# EasyEDA Pro project NRMgmtCRB_v2_final.epro, board PCB1
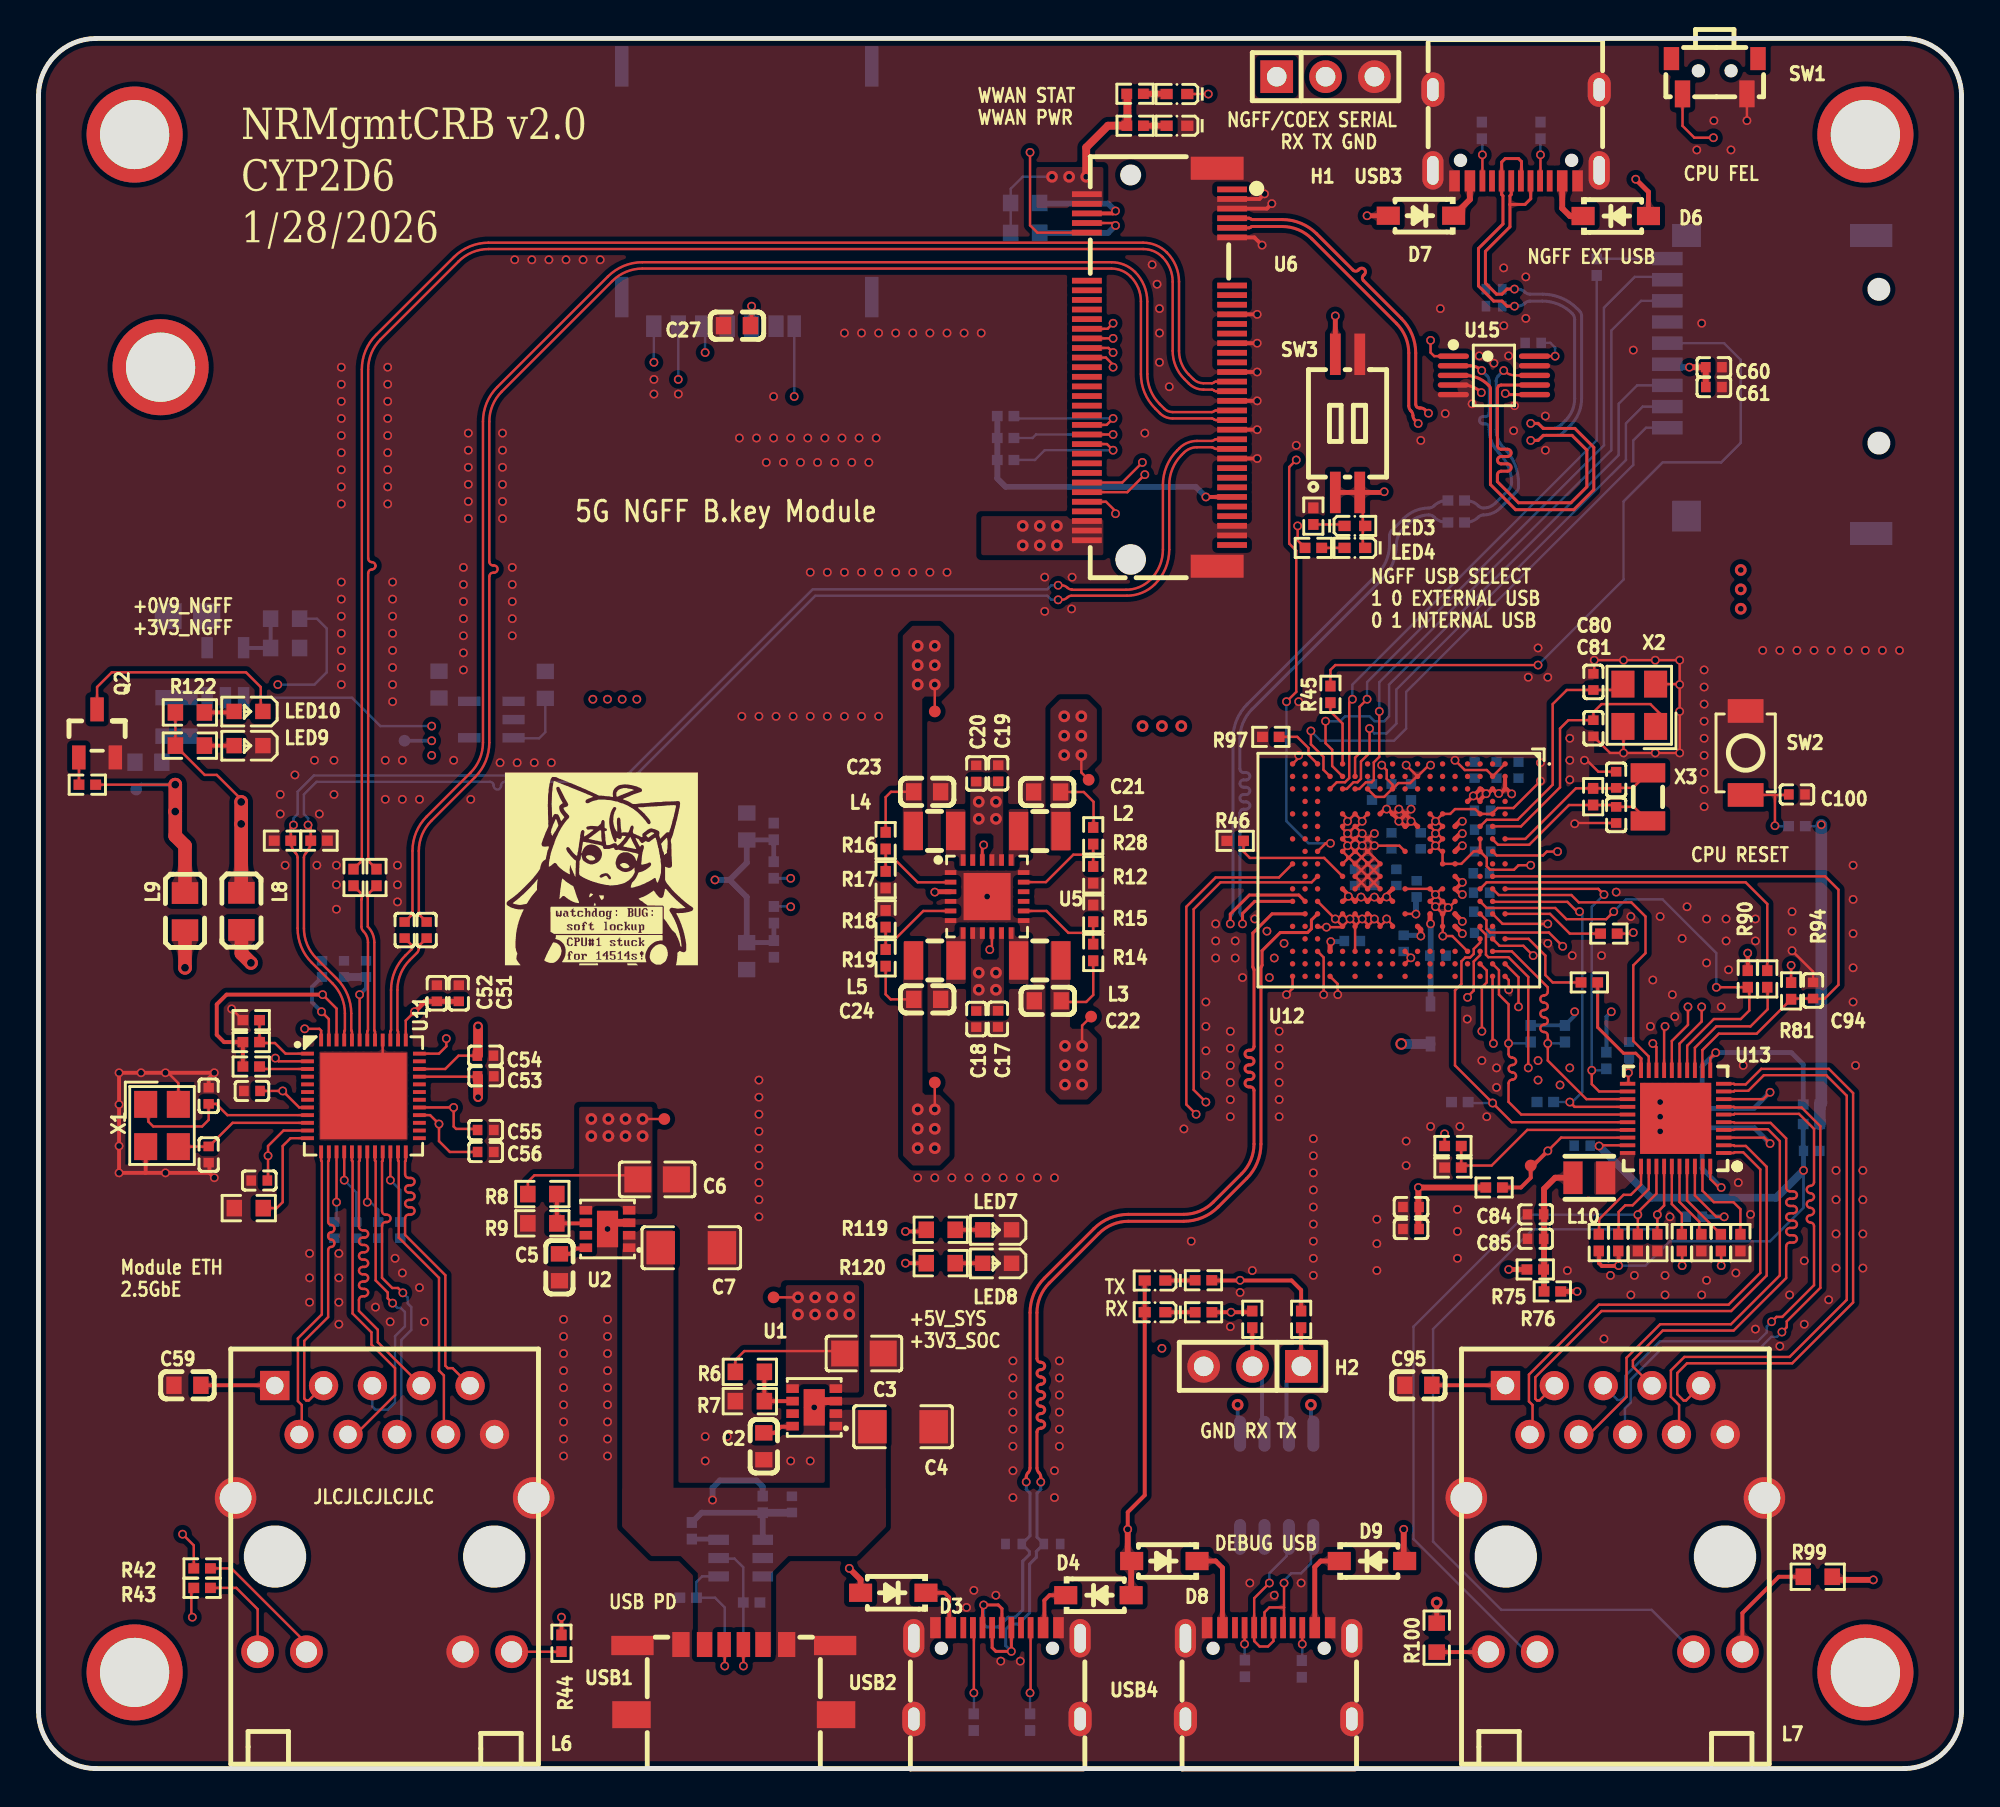
[diagram p3: board, top side]
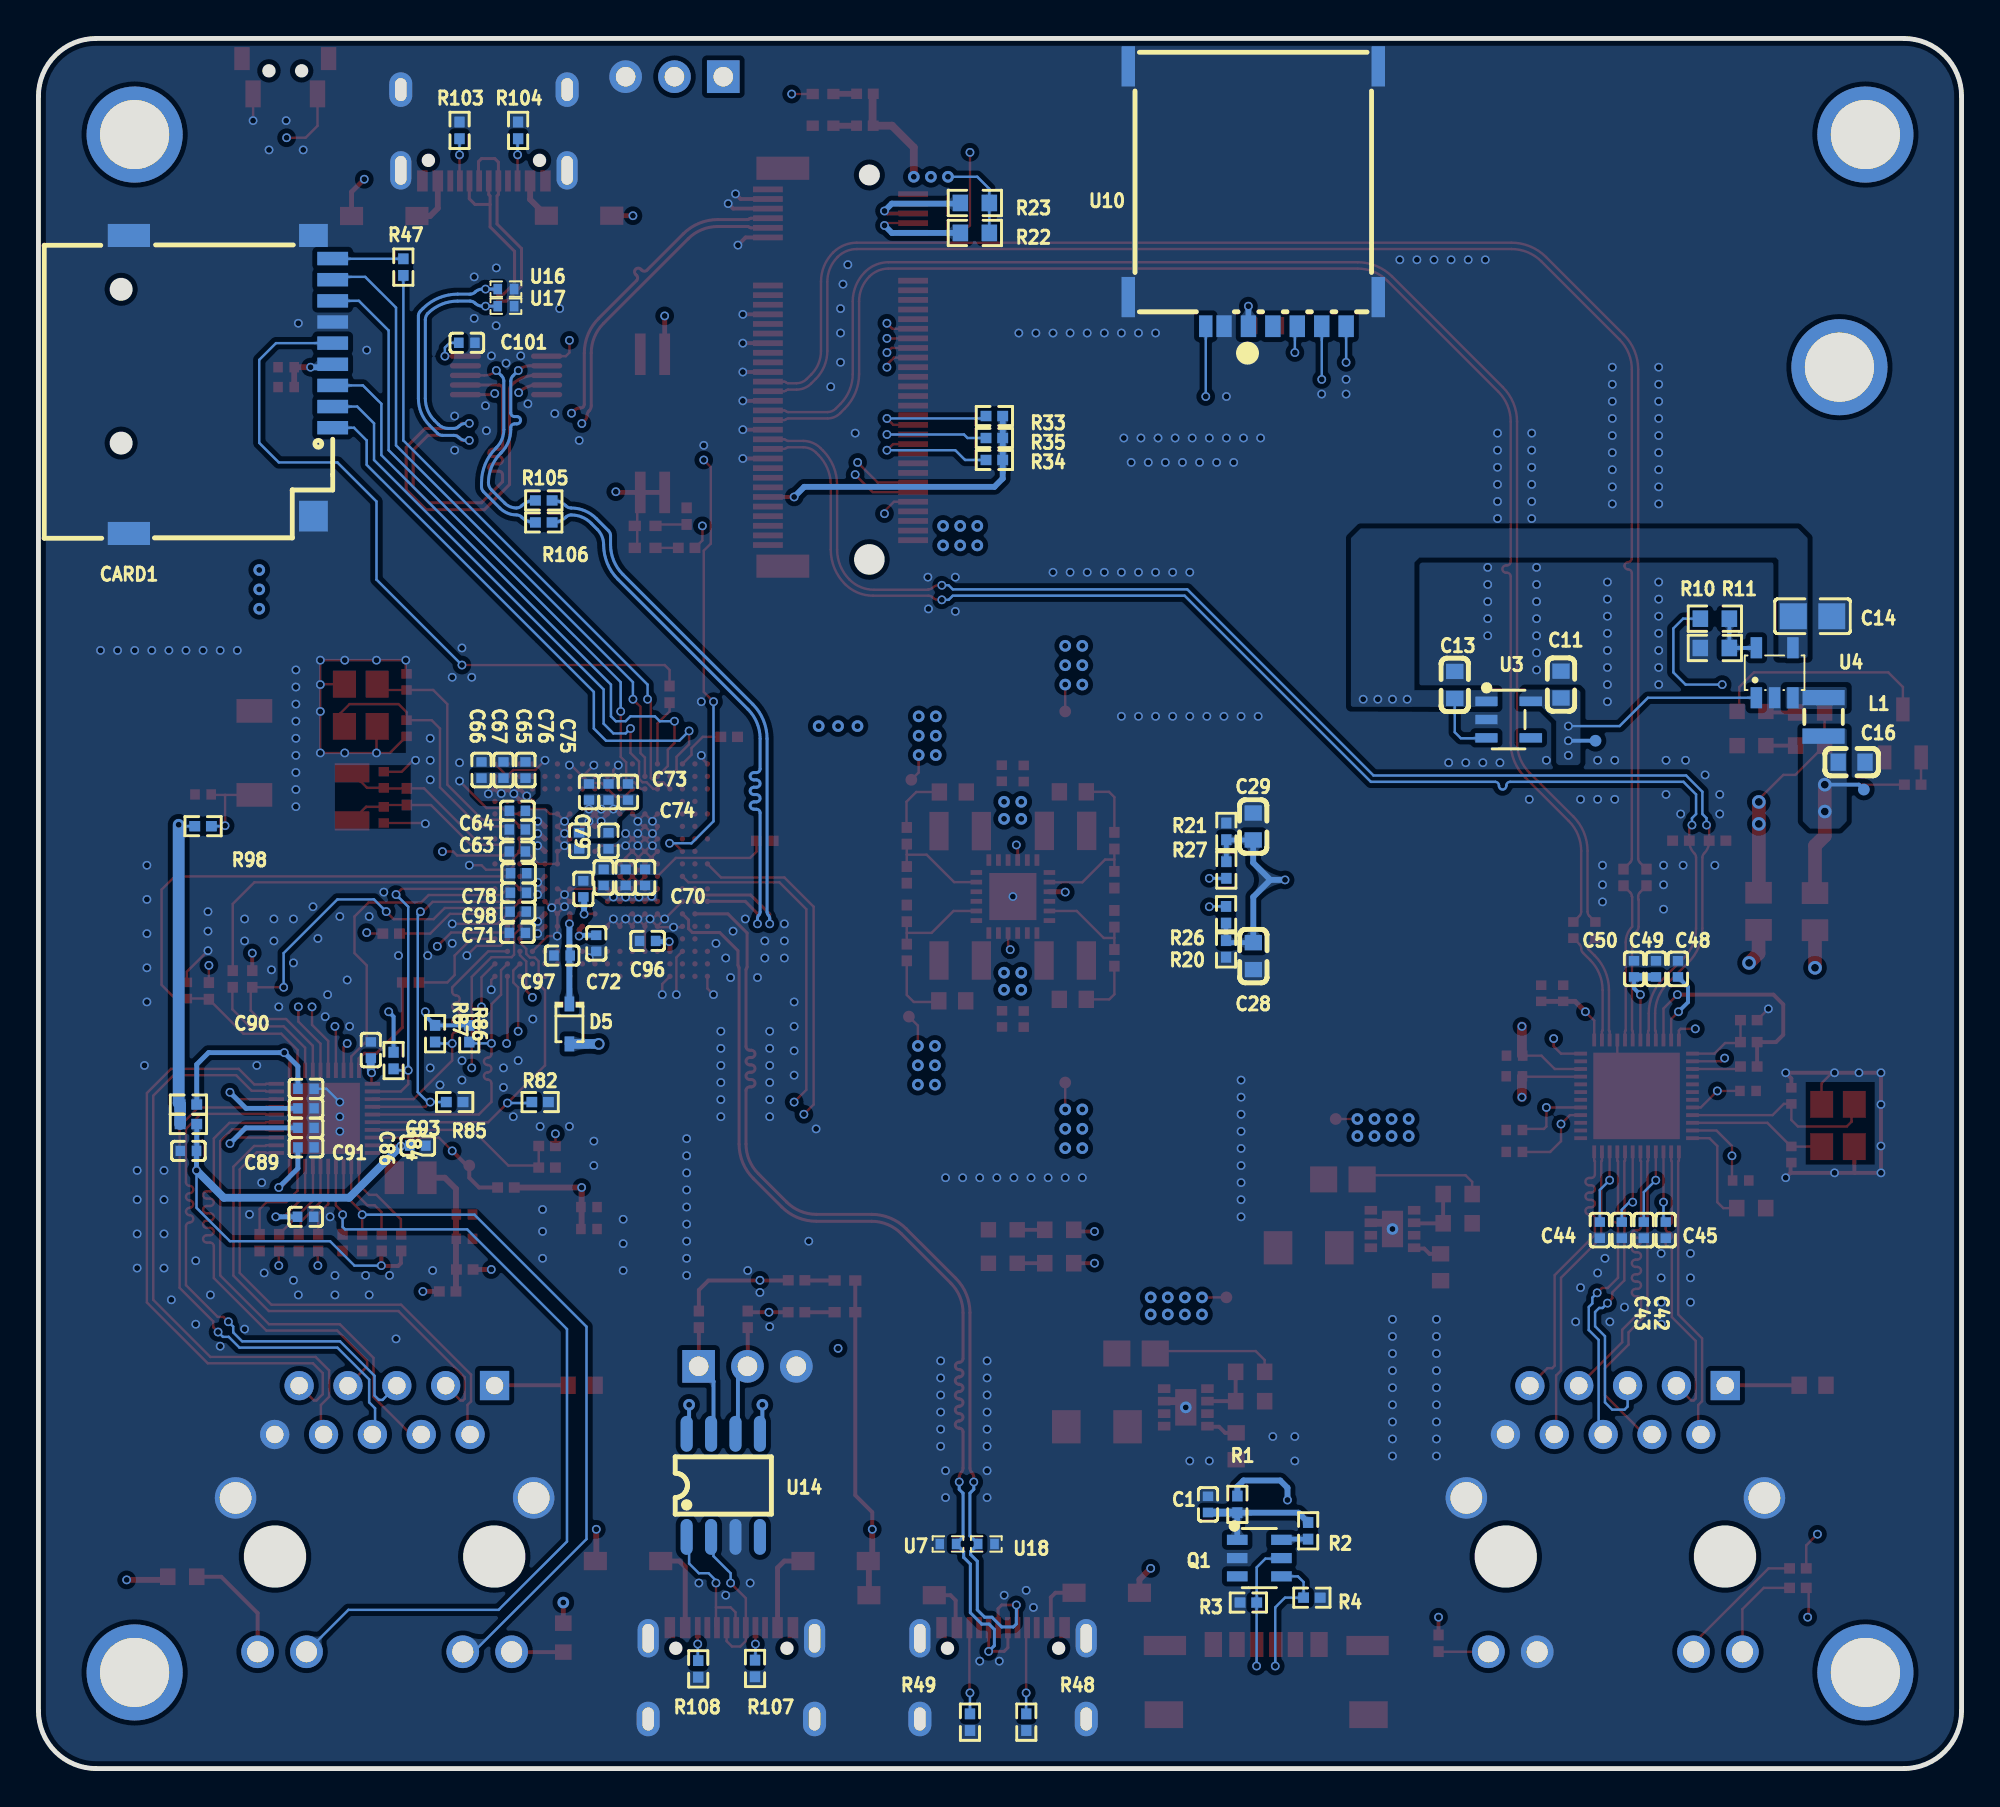
[diagram p4: board, bottom side, seen from below]

Outline 100 x 90 mm; copper layers: Top Layer, GND, PWR, SIG, GND2, Bottom Layer. Coordinates in mm from the lower left corner of the outline.
Outline path: 0,87 0,3 arc(0.88,0.88) 3,0 97,0 arc(99.12,0.88) 100,3 100,87 arc(99.12,89.12) 97,90 3,90 arc(0.88,89.12) 0,87
Stack: Top Layer 0.035mm Outer layer thickness 1oz / Dielectric1 0.0994mm 3313 RC57% 4.2mil / GND 0.0152mm Inner layer thickness / Dielectric2 0.55mm 0.55mm H/H No copper / PWR 0.0152mm Inner layer thickness / Dielectric3 0.1088mm 2116 RC54% 4.9mil / SIG 0.0152mm Inner layer thickness / Dielectric4 0.55mm 0.55mm H/H No copper / GND2 0.0152mm Inner layer thickness / Dielectric5 0.0994mm 3313 RC57% 4.2mil / Bottom Layer 0.035mm Outer layer thickness 1oz

## Design rules (mm)
net RGMII_RXD3: RGMII_RX
net RGMII_RXD1: RGMII_RX
net RGMII_RXD2: RGMII_RX
net RGMII_RXD0: RGMII_RX
net RGMII_RXCTL: RGMII_RX
net RGMII_RXCK: RGMII_RX
net RGMII_TXD1: RGMII_TX
net RGMII_TXCTL: RGMII_TX
net RGMII_TXD0: RGMII_TX
net RGMII_TXD3: RGMII_TX
net RGMII_TXD2: RGMII_TX
net RGMII_TXCK: RGMII_TX
net USBNGFF.D+: DP2
net USBNGFF.D-: DP2
net HSIN: HSI
net HSIP: HSI
net HSON: HSO
net HSOP: HSO
net REFCLK_N: REFCLK
net REFCLK_P: REFCLK
net MDIP0: DP11
net MDIN0: DP11
net MDIP1: DP12
net MDIP2: DP13
net MDIN2: DP13
net MDIN1: DP12
net MDIP3: DP14
net MDIN3: DP14
net $2N99: DP6
net $2N96: DP6
net $2N103: DP5
net $2N100: DP5
net USB0_DP: USB0
net USB1_DP: DP4
net USB0_DM: USB0
net USB1_DM: DP4
net MDI1P0: DP7
net MDI1N0: DP7
net MDI1P1: DP8
net MDI1P2: DP9
net MDI1N2: DP9
net MDI1N1: DP8
net MDI1P3: DP10
net MDI1N3: DP10
net DM_2: DP3
net DP_2: DP3
net DP_1: DP1
net DM_1: DP1
spacing copperThickness1oz (default): track to track 0.102, other pairs 0.102 to 0.381
spacing copperPWR: track to track 0.102, other pairs 0.102 to 0.3
spacing copperRegion: track to track 0.102, other pairs 0.102 to 0.3
spacing copperThickness2oz: track to track 0.203, other pairs 0.152 to 0.3
spacing copperThicknessInner0.5oz: track to track 0.089, other pairs 0.152 to 0.3
track width copperThickness1oz (default): min 0.102, default 0.127, max 2.54
track width 50Ohm: min 0.127, default 0.157, max 2.54
track width copperThickness0.5oz: min 0.089, default 0.254, max 2.54
track width copperThickness2oz: min 0.203, default 0.254, max 2.54
differential pair differentialPair (default): width min 0.127, default 0.254, max 2.54; gap min 0.152, default 0.152
differential pair 100Ohm: width min 0.122, default 0.127, max 2.54; gap min 0.152, default 0.203
differential pair 90Ohm: width min 0.127, default 0.157, max 2.54; gap min 0.152, default 0.203
net GND uses copperRegion_copperThickness1oz
net $3N211 uses copperRegion_copperThickness1oz
net RGMII_RXD3 uses RGMII
net RGMII_RXD1 uses RGMII
net RGMII_RXD2 uses RGMII
net RGMII_RXD0 uses RGMII
net RGMII_RXCTL uses RGMII
net RGMII_RXCK uses RGMII
net class RGMII_RX uses default
net RGMII_TXD1 uses RGMII
net RGMII_TXCTL uses RGMII
net RGMII_TXD0 uses RGMII
net RGMII_TXD3 uses RGMII
net RGMII_TXD2 uses RGMII
net RGMII_TXCK uses RGMII
net class RGMII_TX uses default
net +5V uses copperPWR, copperRegion_copperPWR
net PDIN uses copperRegion, copperRegion_copperRegion
net +3V7_NGFF uses copperPWR, copperRegion_copperPWR
net +0V9_SYS uses copperPWR, copperRegion_copperPWR
net +1V1_CPU uses copperRegion, copperRegion_copperRegion
net +1V5_DRAM uses copperPWR, copperRegion_copperPWR
net USBNGFF.D+ uses 90Ohm
net USBNGFF.D- uses 90Ohm
net HSIN uses 100Ohm
net HSIP uses 100Ohm
net HSON uses 100Ohm
net HSOP uses 100Ohm
net REFCLK_N uses 100Ohm
net REFCLK_P uses 100Ohm
net MDIP0 uses 100Ohm
net MDIN0 uses 100Ohm
net MDIP1 uses 100Ohm
net MDIP2 uses 100Ohm
net MDIN2 uses 100Ohm
net MDIN1 uses 100Ohm
net MDIP3 uses 100Ohm
net MDIN3 uses 100Ohm
net $2N99 uses 100Ohm
net $2N96 uses 100Ohm
net $2N103 uses 100Ohm
net $2N100 uses 100Ohm
net USB0_DP uses 90Ohm
net USB1_DP uses 90Ohm
net USB0_DM uses 90Ohm
net USB1_DM uses 90Ohm
net MDI1P0 uses 100Ohm
net MDI1N0 uses 100Ohm
net MDI1P1 uses 100Ohm
net MDI1P2 uses 100Ohm
net MDI1N2 uses 100Ohm
net MDI1N1 uses 100Ohm
net MDI1P3 uses 100Ohm
net MDI1N3 uses 100Ohm
net RGMII_CLKIN uses 50Ohm
net DM_2 uses 90Ohm
net DP_2 uses 90Ohm
net DP_1 uses 90Ohm
net DM_1 uses 90Ohm
diff pair DP2 uses 90Ohm
diff pair HSI uses 100Ohm
diff pair HSO uses 100Ohm
diff pair REFCLK uses 100Ohm
diff pair DP11 uses 100Ohm
diff pair DP12 uses 100Ohm
diff pair DP13 uses 100Ohm
diff pair DP14 uses 100Ohm
diff pair DP6 uses 100Ohm
diff pair DP5 uses 100Ohm
diff pair USB0 uses 90Ohm
diff pair DP4 uses 90Ohm
diff pair DP7 uses 100Ohm
diff pair DP8 uses 100Ohm
diff pair DP9 uses 100Ohm
diff pair DP10 uses 100Ohm
diff pair DP3 uses 90Ohm
diff pair DP1 uses 90Ohm
pour e2694 uses copperRegion_default, default
pour e2635 uses copperPWR, copperRegion_copperPWR
pour e3130 uses copperRegion_copperThickness1oz, copperThickness1oz

## Placement (name value [footprint] x y rotation side)
C1  1uF  [C0402]  39.18 13.74 270 bottom
C2  3.3nF  [C0603]  37.72 16.76 270 top
C3  22uF  [C0805]  42.93 21.59 180 top
C4  10uF  [C1206]  44.96 17.78 0 top
C5  3.3nF  [C0603]  27.09 26.08 270 top
C6  22uF  [C0805]  32.17 30.65 180 top
C7  10uF  [C1206]  33.95 27.09 0 top
C11  1uF  [C0603]  20.83 56.39 270 bottom
C13  1uF  [C0603]  26.35 56.37 90 bottom
C14  4.7uF  [C0805]  7.75 59.94 180 bottom
C16  10uF  [C0603]  5.72 52.35 0 bottom
C17  10uF  [C0402]  49.9 39 90 top
C18  10uF  [C0402]  48.77 38.99 90 top
C19  10uF  [C0402]  49.91 51.78 270 top
C20  10uF  [C0402]  48.77 51.76 270 top
C21  22uF  [C0603]  52.45 50.8 0 top
C22  22uF  [C0603]  52.48 39.94 0 top
C23  22uF  [C0603]  46.21 50.81 180 top
C24  22uF  [C0603]  46.22 40.01 180 top
C27  100nF  [C0603]  36.32 75.06 0 top
C28  33nF  [C0603]  36.83 42.26 90 bottom
C29  33nF  [C0603]  36.83 49 270 bottom
C40  10uF  [C0402]  11.1 35.25 0 top
C41  2.2uF  [C0402]  11.48 30.59 0 top
C42  2.2uF  [C0402]  16.52 28.01 90 bottom
C43  2.2uF  [C0402]  17.67 28.01 90 bottom
C44  2.2uF  [C0402]  18.81 28.01 90 bottom
C45  100nF  [C0402]  15.38 28.01 90 bottom
C46  100nF  [C0402]  19.04 43.62 90 top
C47  100nF  [C0402]  20.19 43.62 90 top
C48  2.2uF  [C0402]  14.75 41.6 90 bottom
C49  100nF  [C0402]  15.89 41.6 90 bottom
C50  1uF  [C0402]  17.03 41.6 90 bottom
C51  10uF  [C0402]  21.86 40.33 90 top
C52  1uF  [C0402]  20.72 40.33 90 top
C53  2.2uF  [C0402]  23.25 36.01 0 top
C54  2.2uF  [C0402]  23.24 37.08 0 top
C55  100nF  [C0402]  23.25 33.22 0 top
C56  10uF  [C0402]  23.25 32.07 0 top
C57  15pF  [C0402]  8.85 35 270 top
C58  15pF  [C0402]  8.85 31.94 90 top
C59  100nF  [C0603]  7.75 19.94 0 top
C60  10uF  [C0402]  87.12 72.9 180 top
C61  100nF  [C0402]  87.12 71.87 180 top
C62  10uF  [C0402]  75.1 47.7 180 bottom
C63  2.2uF  [C0402]  75.1 48.85 180 bottom
C64  2.2uF  [C0402]  75.1 49.82 180 bottom
C65  10uF  [C0402]  74.68 51.94 270 bottom
C66  2.2uF  [C0402]  76.96 51.94 270 bottom
C67  2.2uF  [C0402]  75.82 51.94 270 bottom
C68  10uF  [C0402]  69.47 46.36 270 bottom
C69  4.7uF  [C0402]  70.61 46.36 270 bottom
C70  4.7uF  [C0402]  68.45 46.36 270 bottom
C71  100nF  [C0402]  75.1 43.47 180 bottom
C72  100nF  [C0402]  70.99 42.93 90 bottom
C73  100nF  [C0402]  69.34 50.8 270 bottom
C74  100nF  [C0402]  70.36 48.26 90 bottom
C75  100nF  [C0402]  70.36 50.8 270 bottom
C76  100nF  [C0402]  71.37 50.8 270 bottom
C77  100nF  [C0402]  75.03 46.58 180 bottom
C78  100nF  [C0402]  75.04 45.56 180 bottom
C79  100nF  [C0402]  71.88 48.26 90 bottom
C80  12pF  [C0402]  80.86 56.53 90 top
C81  12pF  [C0402]  80.86 54.11 270 top
C82  12pF  [C0402]  82.04 49.61 270 top
C83  12pF  [C0402]  82.04 51.44 90 top
C84  4.7uF  [C0402]  77.85 28.83 0 top
C85  100nF  [C0402]  77.85 27.56 0 top
C86  100nF  [C0402]  82.72 37.38 270 bottom
C87  100nF  [C0402]  86.09 34.34 0 bottom
C88  100nF  [C0402]  86.11 28.7 0 bottom
C89  100nF  [C0402]  86.09 33.33 0 bottom
C90  100nF  [C0402]  86.09 35.36 180 bottom
C91  100nF  [C0402]  86.09 32.31 180 bottom
C92  100nF  [C0402]  92.2 32.13 0 bottom
C93  100nF  [C0402]  80.27 32.41 180 bottom
C94  100nF  [C0402]  92.28 40.48 270 top
C95  100nF  [C0603]  71.75 19.94 0 top
C96  2.2uF  [C0402]  68.33 43.05 180 bottom
C97  2.2uF  [C0402]  72.77 42.29 180 bottom
C98  2.2uF  [C0402]  75.06 44.58 180 bottom
C99  2.2uF  [C0402]  71.67 45.76 270 bottom
C100  100nF  [C0402]  91.44 50.67 180 top
C101  10uF  [C0402]  77.72 74.17 0 bottom
C102  4.7uF  [C0402]  71.37 28.07 0 top
C103  100nF  [C0402]  71.37 29.21 0 top
CARD1  TF PUSH  [TF-SMD_TF-PUSH]  90 72 270 bottom
D3  B5819W SL  [SOD-123_L2.7-W1.6-LS3.7-RD-1]  44.45 9.14 180 top
D4  B5819W SL  [SOD-123_L2.7-W1.6-LS3.7-RD-1]  55.12 9.02 0 top
D5  1N4148WS  [SOD-323_L1.7-W1.3-LS2.5-FD]  72.39 38.73 90 bottom
D6  B5819W SL  [SOD-123_L2.7-W1.6-LS3.7-RD-1]  82.02 80.76 0 top
D7  B5819W SL  [SOD-123_L2.7-W1.6-LS3.7-RD-1]  71.89 80.78 180 top
D8  B5819W SL  [SOD-123_L2.7-W1.6-LS3.7-RD-1]  58.55 10.79 180 top
D9  B5819W SL  [SOD-123_L2.7-W1.6-LS3.7-RD-1]  69.34 10.79 0 top
H1  PZ254V-11-03P  [HDR-TH_3P-P2.54-V-M_PZ254V-11-03P]  66.93 88.01 0 top
H2  PZ254V-11-03P  [HDR-TH_3P-P2.54-V-M_PZ254V-11-03P]  63.13 20.92 180 top
L1  2.2uH  [IND-SMD_L2.5-W2.0_MHCHL2520]  7.17 54.71 90 bottom
L2  1.5uH  [IND-SMD_L2.5-W2.0_YXMBL252010P]  52.07 48.77 0 top
L3  1.5uH  [IND-SMD_L2.5-W2.0_YXMBL252010P]  52.07 42.04 0 top
L4  1.5uH  [IND-SMD_L2.5-W2.0_YXMBL252010P]  46.59 48.78 180 top
L5  1.5uH  [IND-SMD_L2.5-W2.0_YXMBL252010P]  46.61 42.04 180 top
L6  HR911130C  [RJ45-TH_HR911130C]  18 13 180 top
L7  HR911130C  [RJ45-TH_HR911130C]  82 13 180 top
L8  GZ2012D101TF  [L0805]  10.56 44.59 270 top
L9  GZ2012D101TF  [L0805]  7.62 44.58 270 top
L10  2.2uH  [IND-SMD_L2.0-W1.6-B]  80.65 30.73 180 top
LED1  SZYY0402B  [LED0402-RD_BLUE]  59.2 87.11 180 top
LED2  SZYY0402B  [LED0402-RD_BLUE]  59.2 85.46 180 top
LED3  SZYY0402B  [LED0402-RD_BLUE]  68.45 64.64 0 top
LED4  SZYY0402B  [LED0402-RD_BLUE]  68.45 63.5 180 top
LED5  SZYY0402B  [LED0402-RD_BLUE]  58.06 25.39 180 top
LED6  SZYY0402B  [LED0402-RD_BLUE]  58.06 23.74 180 top
LED7  KT-0603R  [LED0603-RD]  49.85 28.03 180 top
LED8  KT-0603R  [LED0603-RD]  49.85 26.28 180 top
LED9  KT-0603R  [LED0603-RD]  10.92 53.21 180 top
LED10  KT-0603R  [LED0603-RD]  10.92 54.99 180 top
NOREF  -  [Pad_e2633]  54.61 51.44 0 top
NOREF#2  -  [Pad_e2634]  46.61 54.99 0 top
NOREF#3  -  [Pad_e2668]  32.54 33.79 0 top
NOREF#4  -  [Pad_e62]  77.6 31.37 0 top
NOREF#5  -  [Pad_e3764]  6.35 72.9 180 top
NOREF#6  -  [Pad_e75]  95 5 180 top
NOREF#7  -  [Pad_e2632]  54.74 39.12 0 top
NOREF#8  -  [Pad_e2670]  38.23 24.51 0 top
NOREF#9  -  [Pad_e1559]  19.03 53.47 0 top
NOREF#10  -  [Pad_e74]  95 85 180 top
NOREF#11  -  [Pad_e1561]  5.08 50.93 0 top
NOREF#12  -  [Pad_e73]  5 85 180 top
NOREF#13  -  [Pad_e229]  5 5 180 top
NOREF#14  -  [Pad_e2631]  46.61 35.69 0 top
Q1  CH221K  [SOT-23-6_L2.9-W1.6-P0.95-LS2.8-BL-2]  36.51 10.95 270 bottom
Q2  2N3904S-RTK/PS  [SOT-23-3_L2.9-W1.3-P1.90-LS2.4-TR]  3.05 53.85 270 top
R1  1kΩ  [R0402]  37.66 13.74 90 bottom
R2  47kΩ  [R0402]  33.97 12.37 90 bottom
R3  5.1kΩ  [R0402]  37.08 8.64 180 bottom
R4  5.1kΩ  [R0402]  33.78 8.89 0 bottom
R6  56kΩ  [R0603]  36.99 20.64 180 top
R7  10.5kΩ  [R0603]  36.99 19.11 0 top
R8  40kΩ  [R0603]  26.2 29.89 180 top
R9  11kΩ  [R0603]  26.2 28.36 0 top
R10  100kΩ  [R0603]  12.83 58.29 180 bottom
R11  49.9kΩ  [R0603]  12.83 59.82 180 bottom
R12  10kΩ  [R0402]  54.85 46.49 90 top
R14  10kΩ  [R0402]  54.85 42.45 270 top
R15  20kΩ  [R0402]  54.85 44.49 270 top
R16  10kΩ  [R0402]  44.05 48.27 90 top
R17  12kΩ  [R0402]  44.05 46.24 90 top
R18  10kΩ  [R0402]  44.05 44.2 90 top
R19  15kΩ  [R0402]  44.05 42.17 270 top
R20  100kΩ  [R0402]  38.24 42.64 90 bottom
R21  100kΩ  [R0402]  38.23 48.75 270 bottom
R22  10kΩ  [R0603]  51.31 79.88 180 bottom
R23  10kΩ  [R0603]  51.31 81.44 180 bottom
R26  100kΩ  [R0402]  38.24 44.41 270 bottom
R27  100kΩ  [R0402]  38.23 46.74 90 bottom
R28  45.3kΩ  [R0402]  54.85 48.52 90 top
R31  10kΩ  [R0402]  12.69 48.27 180 top
R32  10kΩ  [R0402]  14.59 48.27 0 top
R33  100kΩ  [R0402]  50.29 70.36 180 bottom
R34  100kΩ  [R0402]  50.29 68.07 180 bottom
R35  100kΩ  [R0402]  50.29 69.22 180 bottom
R36  15kΩ  [R0402]  11.06 38.93 0 top
R37  1kΩ  [R0402]  11.06 37.79 0 top
R38  15kΩ  [R0402]  11.06 36.52 0 top
R39  2.5kΩ  [R0603]  10.94 29.15 0 top
R40  0Ω  [R0402]  16.38 46.36 90 top
R41  0Ω  [R0402]  17.58 46.36 90 top
R42  0Ω  [R0402]  8.51 10.41 180 top
R43  330Ω  [R0402]  8.51 9.4 180 top
R44  2kΩ  [R0402]  27.2 6.52 90 top
R45  33Ω  [R0402]  67.18 55.88 90 top
R46  240Ω  [R0402]  62.23 48.26 180 top
R47  1kΩ  [R0402]  81.03 78.11 90 bottom
R48  5.1kΩ  [R0402]  48.63 2.41 90 bottom
R49  5.1kΩ  [R0402]  51.56 2.41 90 bottom
R50  1MΩ  [R0402]  80.84 50.56 270 top
R73  0Ω  [R0402]  92.2 34.54 180 bottom
R74  0Ω  [R0402]  92.2 33.53 180 bottom
R75  0Ω  [R0402]  77.83 25.96 180 top
R76  0Ω  [R0402]  78.72 24.82 0 top
R77  4.7kΩ  [R0402]  82.15 27.36 270 top
R78  4.7kΩ  [R0402]  83.17 27.36 270 top
R79  4.7kΩ  [R0402]  84.18 27.36 270 top
R80  4.7kΩ  [R0402]  81.14 27.36 270 top
R81  4.7kΩ  [R0402]  91.14 40.45 90 top
R82  4.7kΩ  [R0402]  73.91 34.67 180 bottom
R83  4.7kΩ  [R0402]  73.55 31.26 180 top
R84  4.7kΩ  [R0402]  81.53 36.83 90 bottom
R85  4.7kΩ  [R0402]  78.36 34.67 180 bottom
R86  4.7kΩ  [R0402]  77.6 38.23 90 bottom
R87  4.7kΩ  [R0402]  79.38 38.23 90 bottom
R88  0Ω  [R0402]  87.49 27.36 270 top
R89  0Ω  [R0402]  86.47 27.36 270 top
R90  1.5kΩ  [R0402]  88.88 41.08 90 top
R91  2.49kΩ  [R0402]  88.5 27.36 270 top
R92  33Ω  [R0402]  73.55 32.39 180 top
R93  33Ω  [R0402]  85.45 27.36 270 top
R94  33Ω  [R0402]  89.9 41.08 90 top
R95  33Ω  [R0402]  81.66 43.43 180 top
R96  33Ω  [R0402]  80.65 40.89 180 top
R97  0Ω  [R0402]  64.08 53.67 180 top
R98  47kΩ  [R0402]  91.44 49.02 180 bottom
R99  510Ω  [R0603]  92.52 9.98 0 top
R100  510Ω  [R0603]  72.71 6.81 90 top
R103  5.1kΩ  [R0402]  78.1 85.22 270 bottom
R104  5.1kΩ  [R0402]  75.06 85.22 90 bottom
R105  22Ω  [R0402]  73.72 65.97 0 bottom
R106  22Ω  [R0402]  73.72 64.82 0 bottom
R107  5.1kΩ  [R0402]  62.74 5.21 90 bottom
R108  5.1kΩ  [R0402]  65.69 5.18 270 bottom
R111  100Ω  [R0402]  65.66 23.37 270 top
R112  100Ω  [R0402]  63.12 23.37 270 top
R113  220Ω  [R0402]  60.58 23.74 0 top
R114  220Ω  [R0402]  60.58 25.4 0 top
R115  220Ω  [R0402]  66.29 65.15 270 top
R116  220Ω  [R0402]  66.29 63.5 180 top
R117  100Ω  [R0402]  57.02 87.12 0 top
R118  100Ω  [R0402]  57.03 85.46 0 top
R119  330Ω  [R0603]  46.92 28.03 0 top
R120  150Ω  [R0603]  46.92 26.29 0 top
R121  150Ω  [R0603]  7.87 53.21 0 top
R122  150Ω  [R0603]  7.87 54.94 0 top
R123  200Ω  [R0402]  2.54 51.18 180 top
R124  0Ω  [R0402]  75.69 30.23 180 top
SW1  TS24CA 250gf 013  [SW-SMD_L4.7-W3.5-P3.35-EH]  87.17 88.03 0 top
SW2  TS-1088-AR02016  [SW-SMD_L3.9-W3.0-P4.45]  88.77 52.83 270 top
SW3  1.27-2P TPPT  [SW-SMD_2P-L5.4-W4.1-P1.27-LS8.4]  68.07 69.98 0 top
U1  TPS82130SILR  [USIP-8_L3.0-W2.8-P0.65-TL-EP]  40.34 18.79 180 top
U2  TPS82130SILR  [USIP-8_L3.0-W2.8-P0.65-TL-EP]  29.59 28.07 180 top
U3  RT9193-33GB  [SOT-23-5_L3.0-W1.7-P0.95-LS2.8-BL]  23.55 54.57 270 bottom
U4  TLV62569DBVR  [SOT-23-5_L3.0-W1.7-P0.95-LS2.8-BR]  9.72 57 270 bottom
U5  EA3059QDR  [VQFN-24_L4.0-W4.0-P0.50-TL-EP2.5]  49.33 45.36 0 top
U6  PCIE-67P42H  [PCIE-SMD_75P-P0.50_HYC01B-05NGFF-420]  58.29 72.9 270 top
U7  RCLAMP0521T-ES  [DFN1006-2L-BI]  52.71 11.68 180 bottom
U10  XDSM-0240-2183B  [SIM-SMD_XDSM-0240-2183B]  36.83 81.79 0 bottom
U11  RTL8125BG-CG  [TQFN-48_L6.0-W6.0-P0.40-BL-EP4.5]  16.9 34.99 270 top
U12  R329-N4  [BGA-228_L14.5-W12.0-P0.65-TL_R329-N4]  70.74 46.74 270 top
U13  RTL8211FI-CG  [QFN-40_L5.0-W5.0-P0.40-BL-EP3.7]  85.13 33.82 90 top
U14  CH340N  [SOP-8_L4.9-W3.9-P1.27-LS6.0-BL]  64.39 14.73 180 bottom
U15  CH442E  [MSOP-10_L3.0-W3.0-P0.50-LS5.0-BL]  75.68 72.47 270 top
U16  RCLAMP0521T-ES  [DFN1006-2L-BI]  75.69 76.96 0 bottom
U17  RCLAMP0521T-ES  [DFN1006-2L-BI]  75.69 76.07 0 bottom
U18  RCLAMP0521T-ES  [DFN1006-2L-BI]  50.71 11.68 0 bottom
USB1  TYPE-C 6P QT073  [USB-C-SMD_TYPE-C-6P-QT073]  36.16 4.63 0 top
USB2  TYPE-C 16PIN 2MD(073)  [USB-C-SMD_TYPE-C-6PIN-2MD-073]  49.84 4.95 0 top
USB3  TYPE-C 16PIN 2MD(073)  [USB-C-SMD_TYPE-C-6PIN-2MD-073]  76.84 84.96 180 top
USB4  TYPE-C 16PIN 2MD(073)  [USB-C-SMD_TYPE-C-6PIN-2MD-073]  63.97 4.95 0 top
X1  25MHz  [CRYSTAL-SMD_4P-L3.2-W2.5-BL]  6.42 33.45 270 top
X2  24MHz  [CRYSTAL-SMD_4P-L3.2-W2.5-BL]  83.24 55.31 90 top
X3  32.768kHz  [FC-135R_L3.2-W1.5]  83.69 50.55 270 top

## Footprints (pads in the part's own frame, mm; a bottom-side part is the same pattern mirrored in y, then rotated)
BGA-228_L14.5-W12.0-P0.65-TL_R329-N4
  round 0.28 smd: A1(-5.525,5.525) A2(-4.875,5.525) A3(-4.225,5.525) A4(-3.575,5.525) A5(-2.925,5.525) A7(-1.625,5.525) A9(-0.325,5.525) A11(0.975,5.525) A13(2.275,5.525) A15(3.575,5.525) A17(4.875,5.525) A18(5.525,5.525) B1(-5.525,4.875) B2(-4.875,4.875) B3(-4.225,4.875) B4(-3.575,4.875) B5(-2.925,4.875) B6(-2.275,4.875) B7(-1.625,4.875) B8(-0.975,4.875) B9(-0.325,4.875) B10(0.325,4.875) B11(0.975,4.875) B12(1.625,4.875) B13(2.275,4.875) B14(2.925,4.875) B15(3.575,4.875) B16(4.225,4.875) B17(4.875,4.875) B18(5.525,4.875) C1(-5.525,4.225) C2(-4.875,4.225) C3(-4.225,4.225) C4(-3.575,4.225) C5(-2.925,4.225) C6(-2.275,4.225) C7(-1.625,4.225) C8(-0.975,4.225) C9(-0.325,4.225) C10(0.325,4.225) C11(0.975,4.225) C12(1.625,4.225) C13(2.275,4.225) C14(2.925,4.225) C15(3.575,4.225) C16(4.225,4.225) C17(4.875,4.225) C18(5.525,4.225) D1(-5.525,3.575) D2(-4.875,3.575) D3(-4.225,3.575) D4(-3.575,3.575) D16(4.225,3.575) D17(4.875,3.575) E2(-4.875,2.925) E3(-4.225,2.925) E6(-2.275,2.925) E7(-1.625,2.925) E8(-0.975,2.925) E9(-0.325,2.925) E10(0.325,2.925) E11(0.975,2.925) E12(1.625,2.925) E13(2.275,2.925) E14(2.925,2.925) E16(4.225,2.925) E17(4.875,2.925) E18(5.525,2.925) F1(-5.525,2.275) F2(-4.875,2.275) F3(-4.225,2.275) F5(-2.925,2.275) F6(-2.275,2.275) F7(-1.625,2.275) F8(-0.975,2.275) F9(-0.325,2.275) F11(0.975,2.275) F12(1.625,2.275) F13(2.275,2.275) F14(2.925,2.275) F16(4.225,2.275) F17(4.875,2.275) G2(-4.875,1.625) G3(-4.225,1.625) G5(-2.925,1.625) G6(-2.275,1.625) G7(-1.625,1.625) G8(-0.975,1.625) G11(0.975,1.625) G12(1.625,1.625) G13(2.275,1.625) G16(4.225,1.625) G17(4.875,1.625) G18(5.525,1.625) H1(-5.525,0.975) H2(-4.875,0.975) H3(-4.225,0.975) H6(-2.275,0.975) H14(2.925,0.975) H16(4.225,0.975) H17(4.875,0.975) J2(-4.875,0.325) J3(-4.225,0.325) J5(-2.925,0.325) J6(-2.275,0.325) J8(-0.975,0.325) J11(0.975,0.325) J13(2.275,0.325) J16(4.225,0.325) J17(4.875,0.325) J18(5.525,0.325) K1(-5.525,-0.325) K2(-4.875,-0.325) K3(-4.225,-0.325) K5(-2.925,-0.325) K11(0.975,-0.325) K12(1.625,-0.325) K14(2.925,-0.325) K16(4.225,-0.325) K17(4.875,-0.325) L2(-4.875,-0.975) L3(-4.225,-0.975) L5(-2.925,-0.975) L9(-0.325,-0.975) L10(0.325,-0.975) L11(0.975,-0.975) L12(1.625,-0.975) L14(2.925,-0.975) L16(4.225,-0.975) L17(4.875,-0.975) L18(5.525,-0.975) M1(-5.525,-1.625) M2(-4.875,-1.625) M3(-4.225,-1.625) M5(-2.925,-1.625) M7(-1.625,-1.625) M8(-0.975,-1.625) M9(-0.325,-1.625) M10(0.325,-1.625) M11(0.975,-1.625) M12(1.625,-1.625) M13(2.275,-1.625) M14(2.925,-1.625) M16(4.225,-1.625) M17(4.875,-1.625) N2(-4.875,-2.275) N3(-4.225,-2.275) N5(-2.925,-2.275) N6(-2.275,-2.275) N7(-1.625,-2.275) N8(-0.975,-2.275) N9(-0.325,-2.275) N10(0.325,-2.275) N11(0.975,-2.275) N12(1.625,-2.275) N13(2.275,-2.275) N14(2.925,-2.275) N16(4.225,-2.275) N17(4.875,-2.275) N18(5.525,-2.275) P1(-5.525,-2.925) P2(-4.875,-2.925) P3(-4.225,-2.925) P5(-2.925,-2.925) P6(-2.275,-2.925) P7(-1.625,-2.925) P8(-0.975,-2.925) P9(-0.325,-2.925) P10(0.325,-2.925) P11(0.975,-2.925) P12(1.625,-2.925) P13(2.275,-2.925) P14(2.925,-2.925) P16(4.225,-2.925) P17(4.875,-2.925) R2(-4.875,-3.575) R3(-4.225,-3.575) R16(4.225,-3.575) R17(4.875,-3.575) R18(5.525,-3.575) T1(-5.525,-4.225) T2(-4.875,-4.225) T3(-4.225,-4.225) T4(-3.575,-4.225) T5(-2.925,-4.225) T6(-2.275,-4.225) T7(-1.625,-4.225) T8(-0.975,-4.225) T9(-0.325,-4.225) T10(0.325,-4.225) T11(0.975,-4.225) T12(1.625,-4.225) T13(2.275,-4.225) T14(2.925,-4.225) T15(3.575,-4.225) T16(4.225,-4.225) T17(4.875,-4.225) T18(5.525,-4.225) U1(-5.525,-4.875) U2(-4.875,-4.875) U3(-4.225,-4.875) U4(-3.575,-4.875) U5(-2.925,-4.875) U6(-2.275,-4.875) U7(-1.625,-4.875) U8(-0.975,-4.875) U9(-0.325,-4.875) U10(0.325,-4.875) U11(0.975,-4.875) U12(1.625,-4.875) U13(2.275,-4.875) U14(2.925,-4.875) U15(3.575,-4.875) U16(4.225,-4.875) U17(4.875,-4.875) U18(5.525,-4.875) V1(-5.525,-5.525) V2(-4.875,-5.525) V3(-4.225,-5.525) V5(-2.925,-5.525) V7(-1.625,-5.525) V9(-0.325,-5.525) V11(0.975,-5.525) V12(1.625,-5.525) V14(2.925,-5.525) V16(4.225,-5.525) V17(4.875,-5.525) V18(5.525,-5.525)
C0402
  rect 0.5x0.54 smd: 1(-0.42,0) 2(0.42,0)
C0603
  rect 0.8x0.9 smd: 1(-0.7,0) 2(0.7,0)
C0805
  rect 1.41x1.35 smd: 1(-1,0) 2(1,0)
C1206
  rect 1.485x1.728 smd: 1(-1.593,0) 2(1.593,0)
CRYSTAL-SMD_4P-L3.2-W2.5-BL
  rect 1.4x1.2 smd: 1(-1.1,-0.85) 2(1.1,-0.85) 3(1.1,0.85) 4(-1.1,0.85)
DFN1006-2L-BI
  rect 0.45x0.55 smd: 1(-0.425,0) 2(0.425,0)
FC-135R_L3.2-W1.5
  rect 1x1.8 smd: 1(-1.25,0) 2(1.25,0)
HDR-TH_3P-P2.54-V-M_PZ254V-11-03P
  rect 1.7x1.7 hole 1.02: 1(-2.54,0)
  round 1.7 hole 1.02: 2(0,0) 3(2.54,0)
IND-SMD_L2.0-W1.6-B
  rect 1x1.7 smd: 1(-0.85,0) 2(0.85,0)
IND-SMD_L2.5-W2.0_MHCHL2520
  rect 0.8x2.2 smd: 1(-1,0) 2(1,0)
IND-SMD_L2.5-W2.0_YXMBL252010P
  rect 1x2 smd: 1(1.1,0) 2(-1.1,0)
L0805
  rect 1.133x1.377 smd: 1(-0.966,0) 2(0.966,0)
LED0402-RD_BLUE
  rect 0.636x0.54 smd: 1(-0.538,0) 2(0.538,0)
LED0603-RD
  rect 0.8x0.8 smd: 1(-0.749,0) 2(0.749,0)
MSOP-10_L3.0-W3.0-P0.50-LS5.0-BL
  oval 0.28x1.62 smd: 1(-1,-2.11) 2(-0.5,-2.11) 3(0,-2.11) 4(0.5,-2.11) 5(1,-2.11) 6(1,2.11) 7(0.5,2.11) 8(0,2.11) 9(-0.5,2.11) 10(-1,2.11)
Pad_e62
  round 0.61 smd: TP1(0,0)
Pad_e73
  round 5 hole 3.599: 1(0,0)
Pad_e74
  round 5 hole 3.599: 1(0,0)
Pad_e75
  round 5 hole 3.599: 1(0,0)
Pad_e229
  round 5 hole 3.599: 1(0,0)
Pad_e1559
  round 0.61 smd far side: TP6(0,0)
Pad_e1561
  round 0.61 smd far side: TP7(0,0)
Pad_e2631
  round 0.61 smd: TP2(0,0)
Pad_e2632
  round 0.61 smd: TP3(0,0)
Pad_e2633
  round 0.61 smd: TP4(0,0)
Pad_e2634
  round 0.61 smd: TP5(0,0)
Pad_e2668
  round 0.61 smd: TP1(0,0)
Pad_e2670
  round 0.61 smd: TP1(0,0)
Pad_e3764
  round 5 hole 3.6: 1(0,0)
PCIE-SMD_75P-P0.50_HYC01B-05NGFF-420
  rect 0.3x1.55 smd: 1(-9.25,3.775) 2(-9,-3.775) 3(-8.75,3.775) 4(-8.5,-3.775) 5(-8.25,3.775) 6(-8,-3.775) 7(-7.75,3.775) 8(-7.5,-3.775) 9(-7.25,3.775) 10(-7,-3.775) 11(-6.75,3.775) 20(-4.5,-3.775) 21(-4.25,3.775) 22(-4,-3.775) 23(-3.75,3.775) 24(-3.5,-3.775) 25(-3.25,3.775) 26(-3,-3.775) 27(-2.75,3.775) 28(-2.5,-3.775) 29(-2.25,3.775) 30(-2,-3.775) 31(-1.75,3.775) 32(-1.5,-3.775) 33(-1.25,3.775) 34(-1,-3.775) 35(-0.75,3.775) 36(-0.5,-3.775) 37(-0.25,3.775) 38(0,-3.775) 39(0.25,3.775) 40(0.5,-3.775) 41(0.75,3.775) 42(1,-3.775) 43(1.25,3.775) 44(1.5,-3.775) 45(1.75,3.775) 46(2,-3.775) 47(2.25,3.775) 48(2.5,-3.775) 49(2.75,3.775) 50(3,-3.775) 51(3.25,3.775) 52(3.5,-3.775) 53(3.75,3.775) 54(4,-3.775) 55(4.25,3.775) 56(4.5,-3.775) 57(4.75,3.775) 58(5,-3.775) 59(5.25,3.775) 60(5.5,-3.775) 61(5.75,3.775) 62(6,-3.775) 63(6.25,3.775) 64(6.5,-3.775) 65(6.75,3.775) 66(7,-3.775) 67(7.25,3.775) 68(7.5,-3.775) 69(7.75,3.775) 70(8,-3.775) 71(8.25,3.775) 72(8.5,-3.775) 73(8.75,3.775) 74(9,-3.775) 75(9.25,3.775)
  rect 1.2x2.75 smd: 76(-10.35,3) 77(10.35,3)
QFN-40_L5.0-W5.0-P0.40-BL-EP3.7
  rect 0.2x0.8 smd: 1(-1.8,-2.499) 2(-1.4,-2.499) 3(-1,-2.499) 4(-0.6,-2.499) 5(-0.2,-2.499) 6(0.2,-2.499) 7(0.6,-2.499) 8(1,-2.499) 9(1.4,-2.499) 10(1.8,-2.499) 21(1.8,2.499) 22(1.4,2.499) 23(1,2.499) 24(0.6,2.499) 25(0.2,2.499) 26(-0.2,2.499) 27(-0.6,2.499) 28(-1,2.499) 29(-1.4,2.499) 30(-1.8,2.499)
  rect 0.8x0.2 smd: 11(2.499,-1.8) 12(2.499,-1.4) 13(2.499,-1) 14(2.499,-0.6) 15(2.499,-0.2) 16(2.499,0.2) 17(2.499,0.6) 18(2.499,1) 19(2.499,1.4) 20(2.499,1.8) 31(-2.499,1.8) 32(-2.499,1.4) 33(-2.499,1) 34(-2.499,0.6) 35(-2.499,0.2) 36(-2.499,-0.2) 37(-2.499,-0.6) 38(-2.499,-1) 39(-2.499,-1.4) 40(-2.499,-1.8)
  rect 3.7x3.7 smd: 41(0,0)
R0402
  rect 0.566x0.54 smd: 1(-0.433,0) 2(0.433,0)
R0603
  rect 0.806x0.864 smd: 1(-0.753,0) 2(0.753,0)
RJ45-TH_HR911130C
  round 1.7 hole 1.1: 11(6.604,6.925) 12(4.064,6.925) 13(-4.064,6.925) 14(-6.604,6.925)
  rect 1.524x1.524 hole 0.91: P1(5.715,-6.925)
  round 1.524 hole 0.91: P2(4.445,-4.378) P3(3.175,-6.918) P4(1.905,-4.378) P5(0.635,-6.918) P6(-0.635,-4.378) P7(-1.905,-6.918) P8(-3.175,-4.378) P9(-4.445,-6.918) P10(-5.715,-4.378)
  round 2.159 hole 1.651: SHIELD0(-7.75,-1.079) SHIELD1(7.75,-1.079)
SIM-SMD_XDSM-0240-2183B
  rect 0.7x2.1 smd: 1(-6.5,5.242) 9(6.5,5.242) 10(-6.5,-6.758) 11(6.5,-6.758)
  rect 0.8x1.13 smd: C1(0.25,6.758) C2(-2.29,6.758) C3(-4.83,6.758) C5(1.52,6.758) C6(-1.02,6.758) C7(-3.56,6.758)
  rect 0.7x1.13 smd: CD(2.47,6.758)
SOD-123_L2.7-W1.6-LS3.7-RD-1
  rect 1.2x0.95 smd: 1(-1.7,0) 2(1.7,0)
SOD-323_L1.7-W1.3-LS2.5-FD
  rect 0.78x0.5 smd: 1(-1.04,0) 2(1.04,0)
SOP-8_L4.9-W3.9-P1.27-LS6.0-BL
  oval 0.63x1.865 smd: 1(-1.905,-2.683) 2(-0.635,-2.683) 3(0.635,-2.683) 4(1.905,-2.683) 5(1.905,2.683) 6(0.635,2.683) 7(-0.635,2.683) 8(-1.905,2.683)
SOT-23-3_L2.9-W1.3-P1.90-LS2.4-TR
  rect 1.25x0.7 smd: 1(1.25,0.95) 2(1.25,-0.95) 3(-1.25,0)
SOT-23-5_L3.0-W1.7-P0.95-LS2.8-BL
  rect 0.49x1.157 smd: 1(-0.95,-1.153) 2(0,-1.153) 3(0.95,-1.153)
  rect 0.49x1.175 smd: 4(0.95,1.153) 5(-0.95,1.153)
SOT-23-5_L3.0-W1.7-P0.95-LS2.8-BR
  rect 1.1x0.6 smd: 1(1.3,-0.95) 2(1.3,0) 3(1.3,0.95) 4(-1.3,0.95) 5(-1.3,-0.95)
SOT-23-6_L2.9-W1.6-P0.95-LS2.8-BL-2
  rect 0.532x1.072 smd: 1(-0.95,-1.149) 2(0,-1.149) 3(0.95,-1.149) 4(0.95,1.149) 5(0,1.149) 6(-0.95,1.149)
SW-SMD_2P-L5.4-W4.1-P1.27-LS8.4
  rect 0.56x2.158 smd: 1(-0.635,-3.594) 2(0.635,-3.594) 3(0.635,3.594) 4(-0.635,3.594)
SW-SMD_L3.9-W3.0-P4.45
  rect 1.23x1.86 smd: 1(-2.185,0) 2(2.185,0)
SW-SMD_L4.7-W3.5-P3.35-EH
  rect 0.8x1.4 smd: 1(-1.675,-0.917) 2(1.675,-0.917)
  rect 0.8x1.2 smd: 3(-2.25,0.917) 4(2.25,0.917)
TF-SMD_TF-PUSH
  rect 0.7x1.6 smd: 1(2.25,5.3) 2(1.15,5.3) 3(0.05,5.3) 4(-1.05,5.3) 5(-2.15,5.3) 6(-3.25,5.3) 7(-4.35,5.3) 8(-5.45,5.3) CD(-6.55,5.3)
  rect 1.2x1.5 smd: 10(-7.75,4.3)
  rect 1.2x2.2 smd: 11(-7.75,-5.3) 12(7.75,-5.3)
  rect 1.6x1.5 smd: 13(6.85,4.3)
TQFN-48_L6.0-W6.0-P0.40-BL-EP4.5
  rect 0.2x0.665 smd: 1(-2.2,-2.908) 2(-1.8,-2.908) 3(-1.4,-2.908) 4(-1,-2.908) 5(-0.6,-2.908) 6(-0.2,-2.908) 7(0.2,-2.908) 8(0.6,-2.908) 9(1,-2.908) 10(1.4,-2.908) 11(1.8,-2.908) 12(2.2,-2.908) 25(2.2,2.908) 26(1.8,2.908) 27(1.4,2.908) 28(1,2.908) 29(0.6,2.908) 30(0.2,2.908) 31(-0.2,2.908) 32(-0.6,2.908) 33(-1,2.908) 34(-1.4,2.908) 35(-1.8,2.908) 36(-2.2,2.908)
  rect 0.665x0.2 smd: 13(2.908,-2.2) 14(2.908,-1.8) 15(2.908,-1.4) 16(2.908,-1) 17(2.908,-0.6) 18(2.908,-0.2) 19(2.908,0.2) 20(2.908,0.6) 21(2.908,1) 22(2.908,1.4) 23(2.908,1.8) 24(2.908,2.2) 37(-2.908,2.2) 38(-2.908,1.8) 39(-2.908,1.4) 40(-2.908,1) 41(-2.908,0.6) 42(-2.908,0.2) 43(-2.908,-0.2) 44(-2.908,-0.6) 45(-2.908,-1) 46(-2.908,-1.4) 47(-2.908,-1.8) 48(-2.908,-2.2)
  rect 4.5x4.5 smd: 49(0,0)
USB-C-SMD_TYPE-C-6P-QT073
  rect 2x1.4 smd: 7(-5.32,-1.825) 7(5.32,-1.825)
  rect 2.2x1 smd: 7(-5.269,1.775) 7(5.269,1.775)
  rect 0.7x1.3 smd: A5(-0.5,1.825) B5(0.5,1.825)
  rect 0.8x1.3 smd: A9(1.52,1.825) B9(-1.52,1.825)
  rect 0.9x1.3 smd: A12(2.75,1.825) B12(-2.75,1.825)
USB-C-SMD_TYPE-C-6PIN-2MD-073
  rect 0.55x1.1 smd: 1(-3.2,2.375) 2(-2.4,2.375) 11(2.4,2.375) 12(3.2,2.375)
  rect 0.3x1.1 smd: 3(-1.75,2.375) 4(-1.25,2.375) 5(-0.75,2.375) 6(-0.25,2.375) 7(0.25,2.375) 8(0.75,2.375) 9(1.25,2.375) 10(1.75,2.375)
  oval 1.1x2 hole 0.6x1.5: 13(-4.325,1.825) 14(4.325,1.825)
  oval 1.2x1.8 hole 0.6x1.2: 13(-4.325,-2.375) 14(4.325,-2.375)
USIP-8_L3.0-W2.8-P0.65-TL-EP
  rect 0.65x0.45 smd: 1(-1.125,0.975) 2(-1.125,0.325) 3(-1.125,-0.325) 4(-1.125,-0.975) 5(1.125,-0.975) 6(1.125,-0.325) 7(1.125,0.325) 8(1.125,0.975)
  rect 1.1x1.9 smd: 9(0,0)
VQFN-24_L4.0-W4.0-P0.50-TL-EP2.5
  rect 0.6x0.25 smd: 1(-1.9,1.25) 2(-1.9,0.75) 3(-1.9,0.25) 4(-1.9,-0.25) 5(-1.9,-0.75) 6(-1.9,-1.25) 13(1.9,-1.25) 14(1.9,-0.75) 15(1.9,-0.25) 16(1.9,0.25) 17(1.9,0.75) 18(1.9,1.25)
  rect 0.25x0.6 smd: 7(-1.25,-1.9) 8(-0.75,-1.9) 9(-0.25,-1.9) 10(0.249,-1.9) 11(0.75,-1.9) 12(1.25,-1.9) 19(1.25,1.9) 20(0.75,1.9) 21(0.249,1.9) 22(-0.25,1.9) 23(-0.75,1.9) 24(-1.25,1.9)
  rect 2.45x2.45 smd: 25(0,0)

## Nets
As in the schematic, except:
+0V9_NGFF: C16.2 C40.2 C48.1 C51.1 C52.1 C56.1 L1.1 L9.1 NOREF#11.TP7 R11.1 R123.1 U11.8 U11.28 U11.37 U11.47
+0V9_SYS: C22.2 C62.2 C63.2 C64.2 L3.1 NOREF#7.TP3 R14.2 U12.E6 U12.E7 U12.E8
+1V1_CPU: C23.2 C65.2 C66.2 C67.2 L4.1 NOREF#2.TP5 R16.2 U12.A2 U12.A3 U12.B3 U12.C3 U12.C4 U12.D4
+1V5_DRAM: C24.2 C68.2 C69.2 C70.2 L5.1 NOREF#14.TP2 R19.2 U12.K11 U12.K12 U12.L12 U12.M12 U12.N12 U12.P11 U12.P12
+3V3_NGFF: C11.2 C49.1 C50.1 C55.1 L8.1 NOREF#9.TP6 R37.1 R38.1 R121.1 R122.1 U3.5 U4.1 U11.29 U11.43 U11.46
+3V3_SOC: C21.2 C28.2 C29.2 C60.2 C61.2 C73.2 C74.2 C75.2 C76.2 C77.2 C78.2 C79.2 C102.2 C103.2 CARD1.4 D5.1 L2.1 NOREF.TP4 R20.2 R21.2 R26.2 R27.2 R28.2 R73.1 R74.1 R98.1 R99.2 R100.2 R120.1 R124.2 U12.E10 U12.E11 U12.H6 U12.J5 U12.J6 U12.K5 U12.L5 U14.5 U14.8
+3V7_NGFF: C6.2 C13.1 C14.1 NOREF#3.TP1 R8.2 R22.2 R23.2 R43.2 R44.2 R117.1 R118.1 U2.4 U2.5 U3.1 U3.3 U4.4 U6.2 U6.4 U6.70 U6.72 U6.74
+5V: C3.2 C17.2 C18.2 C19.2 C20.2 C101.2 D3.2 D4.2 D6.2 D7.2 D8.2 D9.2 LED5.2 LED6.2 NOREF#8.TP1 R6.2 R116.2 R119.1 SW3.4 U1.4 U1.5 U5.3 U5.8 U5.9 U5.11 U5.20 U5.21 U5.23 U15.10
DVDD_RG: NOREF#4.TP1 R84.2 R86.2 R87.2 R90.2 R124.1 U13.28

Pads without a net: NOREF#5 1; NOREF#6 1; NOREF#10 1; NOREF#12 1; NOREF#13 1; Q1 3; SW1 3 4; U1 7; U2 7; U3 4; U5 15 16; U6 1 20 21 22 23 24 25 26 28 29 31 35 37 38 40 42 44 46 48 56 58 59 60 61 63 67 68 69 75; U10 C6; U11 4 5 6 7 25 26 27 30 31 32 35; U12 A4 A5 A9 B1 B4 B9 B14 C1 C2 C9 C10 C18 D1 D2 D3 D17 E2 E3 E16 E17 E18 F1 F2 F3 F16 F17 G2 G3 G16 G17 G18 H1 H3 H16 H17 J2 J3 J18 K1 K2 K16 K17 L2 L3 L16 L17 L18 M1 M2 M16 M17 N17 N18 P16 P17 R17 T2 T3 T4 T5 T6 T7 T9 T11 T15 T17 T18 U1 U2 U3 U4 U5 U6 U7 U8 U9 U10 U11 U14 U15 U16 U17 U18 V2 V3 V5 V7 V11 V14 V16 V17; U14 4; USB2 3 9; USB3 3 9; USB4 3 9

## Via types
v1: diameter 0.457, hole 0.305, Top Layer to Bottom Layer, 647 vias
v2: diameter 0.61, hole 0.305, Top Layer to Bottom Layer, 68 vias
v3: diameter 0.711, hole 0.406, Top Layer to Bottom Layer, 6 vias
v4: diameter 0.61, hole 0.406, Top Layer to Bottom Layer, 1 via

## Routing (per net, layer and track width the routed paths; a pad name or vN(x,y) marks a point on that pad's centre or on a via; arc(x,y) is an arc through that point)
+0V9_NGFF: length 82.2
  Top Layer w0.127: 22.83,32.07 21.39,32.07 20.83,32.64 v1(20.83,33.53) 20.37,33.99 U11.28 ; C40.2 v1(12.7,35.25) 13.56,34.39 U11.8 ; v1(14.72,39.37) 15.1,38.99 U11.47 ; U11.37 19.1,38.91 v1(19.56,39.37) ; 2.97,51.18 v3(7.11,51.18)
  Top Layer w0.254: C51.1 C52.1 20.1,39.91 v1(19.56,39.37)
  Top Layer w0.711: 7.62,45.54 7.62,48.01 7.11,48.51 v3(7.11,49.78) v3(7.11,51.18)
  PWR w0.127: v1(12.45,56.39) 7.24,51.18 v3(7.11,51.18)
  PWR w0.508: v1(12.7,35.25) 12.7,33.02 13.46,32.26 19.69,32.26 20.83,33.4 v1(20.83,33.53) 20.83,35.94 19.56,37.21 v1(19.56,39.37) v1(14.72,39.37) 13.46,39.37 12.45,38.35 9.27,38.35 8.64,38.99 8.64,42.42 7.11,43.94 v3(7.11,49.78)
  Bottom Layer w0.127: R11.1 14.48,59.82 14.99,59.31 14.99,57.02 14.35,56.39 v1(12.45,56.39)
  Bottom Layer w0.203: v3(7.11,51.18) 5.33,51.18 NOREF#11.TP7 ; C48.1 14.22,40.66 14.22,39.86 v1(14.72,39.37)
+0V9_SYS: length 6.8
  Top Layer w0.127: v2(54.27,37.59) 54.27,38.65 NOREF#7.TP3 ; C22.2 53.24,39.88 54.48,39.88 54.85,40.24 R14.2
  Top Layer w0.254: U12.E8 73.96,48.01 v1(74.04,48.01) ; U12.E6 73.93,49.28 v1(74.04,49.28) ; U12.E7 73.94,48.64 v1(74.04,48.64)
  vias: v2(53.38,37.59) v2(53.38,36.58) v2(53.38,35.58) v2(54.27,36.58) v2(54.27,35.58)
+1V1_CPU: length 9.5
  Top Layer w0.127: U12.C4 74.68,50.6 v1(74.61,50.6) ; U12.A3 76.35,50.96 ; C23.2 44.33,50.81 44.05,50.53 R16.2 ; v2(46.61,56.39) NOREF#2.TP5
  Top Layer w0.203: v1(75.28,50.71) 75.36,50.71 U12.B3 75.85,50.72 v1(75.94,50.72) 76.02,50.72 U12.A3 U12.A2 ; v1(75.28,50.71) 75.03,50.96 U12.C3 74.96,50.95 v1(74.61,50.6) 74.33,50.31 U12.D4 ; v1(75.28,50.71) 74.96,50.39 U12.C4 ; 76.35,50.96 76.6,50.7
  vias: v1(76.61,50.7) v2(45.72,58.4) v2(45.72,57.4) v2(45.72,56.39) v2(46.61,58.4) v2(46.61,57.4)
+1V5_DRAM: length 8.9
  Top Layer w0.127: C24.2 44.31,40.01 44.05,40.28 R19.2 ; v2(46.61,34.29) NOREF#14.TP2
  Top Layer w0.203: U12.L12 69.99,45.34 v1(70.1,45.34) ; v1(68.12,45.37) 68.12,45.46 67.81,45.76 ; v1(68.12,45.37) 68.2,45.37 U12.N12 68.69,45.33 v1(68.77,45.33) 68.89,45.33 U12.M12 69.34,45.33 v1(69.47,45.33) ; v1(68.12,45.37) 67.85,45.11 U12.P12 ; U12.K12 70.19,45.34 v1(70.1,45.34) ; v1(70.1,45.34) 70.1,45.45 70.41,45.76
  Top Layer w0.254: U12.L12 69.54,45.33 v1(69.47,45.33)
  vias: v2(45.72,34.29) v2(45.72,33.28) v2(45.72,32.27) v2(46.61,33.28) v2(46.61,32.27)
+3V3_NGFF: length 84.1
  Top Layer w0.127: U11.29 v1(21.59,34.39) 21.59,33.4 21.72,33.27 22.78,33.27 22.83,33.22 ; R122.1 R121.1 8.64,51.69 9.27,51.69 10.54,50.42 ; U11.43 v1(16.7,40.26) ; U11.46 15.5,39.53 v1(14.78,40.26)
  Top Layer w0.203: R38.1 R37.1 9.65,37.79 9.27,38.17 9.27,39.75 9.78,40.26 v1(14.78,40.26)
  Top Layer w0.711: v3(10.54,50.28) v3(10.54,49.14) 10.54,45.57 L8.1
  PWR w0.508: v1(21.59,34.39) 22.1,34.9 22.1,39.5 21.34,40.26 v1(16.7,40.26) v1(14.78,40.26) 10.67,40.26 9.65,41.28 9.65,48.25 v3(10.54,49.14)
  PWR w0.711: v3(10.54,49.14) v3(10.54,50.28) 10.54,51.56 12.45,53.47 v1(20.45,53.47)
  Bottom Layer w0.127: U4.1 16.31,55.7 17.78,54.23 v1(20.45,54.23)
  Bottom Layer w0.203: v1(16.7,40.26) 17.03,40.59 C50.1 ; v1(20.45,53.47) NOREF#9.TP6
  Bottom Layer w0.406: C49.1 C50.1
  vias: v1(20.45,52.7)
+3V3_SOC: length 225.2
  Top Layer w0.127: 53.15,50.8 54.36,50.8 54.86,50.29 54.86,48.97 R28.2 ; v2(54.23,52.72) 54.23,51.82 NOREF.TP4
  Top Layer w0.203: v1(71.37,49.28) 71.11,49.01 U12.J6 70.8,49.28 v1(70.74,49.28) ; v1(71.37,49.28) 71.37,49.35 U12.J5 ; v1(71.37,49.28) 71.45,49.28 U12.H6 ; U12.K5 70.74,49.34 v1(70.74,49.28) ; U12.K5 70.16,49.91 v1(70.1,49.91) 70.01,49.91 U12.L5 ; U12.K5 70.49,49.66 v1(70.74,49.91) 70.81,49.91 U12.J5 ; U12.J5 71.06,49.6 v1(70.74,49.28) ; U12.J5 71.12,49.66 v1(71.37,49.91) ; v1(74.04,45.47) 73.96,45.47 73.66,45.76 73.7,45.76 v1(74.04,46.1) 73.97,46.1 U12.E10 ; 46.17,26.29 v1(45.09,26.29)
  Top Layer w0.254: R100.2 v2(72.71,8.64)
  Top Layer w0.305: C102.2 71.75,28.11 v1(71.75,30.23) R124.2 ; C61.2 C60.2 v1(85.85,72.9) ; v1(95.41,9.82) 93.44,9.82 R99.2
  PWR w0.305: 53.15,53.66 36.65,53.66 35.18,52.2 v1(35.18,46.23) ; v1(71.75,30.23) 70.36,30.23 69.6,30.99 69.6,33.4 70.87,34.67 v4(70.87,37.69)
  PWR w0.508: v1(74.04,46.1) 74.04,45.47 v1(74.04,45.47) 75.44,44.07 75.44,41.78 74.42,40.77 72.64,40.77 70.87,38.99 v4(70.87,37.69)
  SIG w0.127: v1(58.42,21.86) 55.23,21.86 54.36,22.73 54.36,23.88 53.34,24.89 45.59,24.89 45.09,25.4 v1(45.09,26.29)
  SIG w0.305: v2(58.42,54.23) v1(58.42,21.86) 58.42,20.83 60.32,18.92 v2(62.36,18.92) 62.37,18.91 66.16,18.91 v2(66.17,18.92) 70.99,18.92 72.01,17.91 72.01,12.32 72.71,11.62 v2(72.71,8.64) 94.23,8.64 v1(95.41,9.82) ; v1(85.85,72.9) 85.85,71.12 88.52,68.45 v2(88.52,62.35)
  SIG w0.61: v2(88.52,60.33) 88.52,57.15 92.71,52.96 v1(92.71,49.1)
  Bottom Layer w0.127: R98.1 92.63,49.02 v1(92.71,49.1)
  Bottom Layer w0.203: 66.17,17.41 v2(66.17,18.92) ; 62.36,17.41 v2(62.36,18.92)
  Bottom Layer w0.254: R26.2 R20.2 38.14,42.96 C28.2 ; R27.2 R21.2 38.22,48.31 C29.2
  Bottom Layer w0.305: C28.2 36.83,42.97 36.83,45.34 35.94,46.23 ; v1(35.18,46.23) 35.94,46.23 ; 35.94,46.23 36.83,47.12 C29.2 ; CARD1.4 84.85,72.9 v1(85.85,72.9)
  Bottom Layer w0.508: D5.1 v4(70.87,37.69)
  Bottom Layer w0.61: R74.1 R73.1 92.71,34.62 v1(92.71,49.1)
  vias: v2(53.34,54.74) v2(53.34,53.73) v2(53.34,52.72) v2(54.23,54.74) v2(54.23,53.73) v2(57.41,54.23) v2(59.43,54.23) v2(88.52,61.34)
+3V7_NGFF: length 69.1
  Top Layer w0.127: 7.95,9.4 7.95,7.93 v1(8,7.87) ; NOREF#3.TP1 v2(31.42,33.79) ; R8.2 25.45,30.52 25.79,30.86 30.96,30.86 C6.2
  Top Layer w0.203: 27.2,6.95 v1(27.2,7.87)
  Top Layer w0.406: 56.63,87.1 56.63,85.47 56.62,85.46 55.62,85.46 54.48,84.33 v2(54.48,82.8)
  PWR w0.305: v2(28.75,32.9) 28.75,9.43 v1(27.2,7.87) v1(8,7.87)
  Bottom Layer w0.127: C13.1 26.35,53.91 26.03,53.59 24.73,53.59 U3.3 ; R22.2 R23.2 50.55,82.18 51.18,82.8 v2(52.71,82.8)
  vias: v1(28.83,55.63) v1(29.59,55.63) v1(30.35,55.63) v1(31.12,55.63) v2(28.75,33.79) v2(29.64,33.79) v2(29.64,32.9) v2(30.53,33.79) v2(30.53,32.9) v2(31.42,32.9) v2(51.18,64.64) v2(51.18,63.63) v2(52.07,64.64) v2(52.07,63.63) v2(52.96,64.64) v2(52.96,63.63) v2(53.59,82.8)
+5V: length 202.1
  Top Layer w0.127: C3.2 41.8,21.72 36.7,21.72 36.24,21.25 R6.2 ; 65.86,63.5 65.48,63.88 v1(65.48,64.64) ; U15.10 v1(78.87,73.47) ; NOREF#8.TP1 v2(39.5,24.51)
  Top Layer w0.203: LED5.2 LED6.2 57.53,14.22 56.64,13.34 v1(56.64,12.45) ; v1(45.09,27.94) 46.08,27.94 46.17,28.03
  Top Layer w0.254: v1(46.61,45.59) 46.63,45.61 U5.3 ; 70.19,80.78 v1(69.09,80.78) ; v1(83.06,82.68) 83.72,82.02 D6.2 ; SW3.4 v1(67.44,75.56)
  Top Layer w0.305: v1(70.99,12.45) 70.99,10.84 D9.2 ; v1(42.16,10.41) 42.75,9.83 D3.2 ; v1(56.64,12.45) 56.64,11 D8.2 56.82,10.77 D4.2
  PWR w0.127: 65.46,64.63 v1(65.48,64.64) 64.53,64.64 64.52,64.63
  PWR w0.508: v2(48.9,50.29) 43.18,50.29 42.16,51.31 38.74,51.31 37.59,50.17 37.59,45.21 36.83,44.45 34.42,44.45 33.78,45.08 33.78,54.61 39.88,60.71 48.57,60.71 49.71,59.56 62.87,59.56 64.52,61.21 64.52,74.8 65.28,75.56 v1(67.44,75.56) 67.44,79.13 v1(69.09,80.78) 76.47,80.78 ; 76.47,80.78 81.16,80.78 v1(83.06,82.68) ; 76.47,80.78 76.47,79.27 76.87,78.87 78.97,78.87 79.5,78.33 79.5,74.11 v1(78.87,73.47) ; v1(70.99,12.45) v1(56.64,12.45) 54.61,10.41 v1(42.16,10.41) v2(42.16,23.62) v2(42.16,24.51)
  SIG w0.127: v1(45.09,27.94) 44.45,27.94 43.81,27.31 43.81,25.15 43.18,24.51 v2(42.16,24.51)
  Bottom Layer w0.127: C101.2 78.61,74.17 78.87,73.91 v1(78.87,73.47)
  vias: v2(39.5,23.62) v2(40.39,24.51) v2(40.39,23.62) v2(41.28,24.51) v2(41.28,23.62) v2(48.9,49.4) v2(48.9,41.4) v2(48.9,40.51) v2(49.79,50.29) v2(49.79,49.4) v2(49.79,41.4) v2(49.79,40.51)
AVCC: length 12.9
  Top Layer w0.254: v1(71.88,43.31) 71.88,43.64 U12.H14 ; v1(67.2,43.02) 67.16,42.98 U12.R16 ; U12.E14 v1(74.04,43.43) ; v1(74.04,44.07) 73.66,44.45 U12.E13
  PWR w0.406: v1(67.2,43.02) 67.49,43.31 v1(71.88,43.31) 71.88,42.8 72.26,42.42 73.66,42.42 74.04,42.8 v1(74.04,43.43) v1(74.04,44.07)
  Bottom Layer w0.254: v1(67.2,43.02) 67.87,43.02 C96.2 ; C72.2 71.84,43.35 v1(71.88,43.31)
AVDD10: length 37.7
  Top Layer w0.127: v1(90.04,35.18) 89.69,34.82 87.63,34.82 ; 87.63,32.82 89.73,32.82 v1(90.04,32.51) ; U13.38 86.13,29.82 87.25,28.7 v1(87.66,28.7)
  Top Layer w0.254: R76.2 v1(80.01,24.82)
  PWR w0.406: v1(90.04,35.18) v1(90.04,32.51) 90.04,31.09 v1(87.66,28.7) 86.51,29.84 82.17,29.84 80.9,28.58 80.9,25.71 v1(80.01,24.82)
  Bottom Layer w0.254: v1(90.04,35.18) 89.21,34.34 C87.2 ; C89.2 89.23,33.33 v1(90.04,32.51) ; v1(87.66,28.7) 86.65,28.7 86.53,28.83
AVDD33: length 21.1
  Top Layer w0.127: v1(87.5,30.23) 87.38,30.23 86.93,30.67 U13.40 ; U13.11 86.93,36.96 v1(87.22,37.24)
  PWR w0.406: v1(87.22,37.24) 87.5,36.96 v1(87.5,30.23)
  Bottom Layer w0.254: v1(87.5,30.23) 86.51,31.22 C91.1 ; C90.1 86.51,36.53 v1(87.22,37.24) 91.16,37.24 91.77,36.63 R73.2
DVDD10: length 15.1
  Top Layer w0.127: U13.21 82.68,35.66 v1(82.68,36.19)
  Top Layer w0.254: R75.2 v1(76.45,25.96)
  PWR w0.406: v1(82.68,36.19) 80.14,33.66 80.14,29.64 v1(76.45,25.96)
  Bottom Layer w0.406: v1(82.68,36.19) 82.72,36.23 C86.2
DVDD33: length 43.8
  Top Layer w0.127: R81.2 v1(91.14,41.78) ; U13.29 81.19,32.42 v1(81.15,32.39)
  Top Layer w0.203: R77.2 82.17,26.91 v1(82.17,26.16) 82.15,26.15 81.3,26.15 81.15,26.29 81.15,26.91 R80.2
  PWR w0.127: v1(91.14,41.78) 91.78,41.14 v1(91.78,31.11)
  Bottom Layer w0.127: 81.13,32.41 C93.1 ; v1(82.17,26.16) 83.57,26.16 84.84,27.43 90.04,27.43 91.78,29.17 v1(91.78,31.11)
  Bottom Layer w0.254: R74.2 91.77,32.14 C92.1 v1(91.78,31.11)
  Bottom Layer w0.406: v1(91.78,31.11) 90.36,29.69 83.85,29.69 v1(81.15,32.39)
DVDD_RG: length 33.2
  Top Layer w0.127: v1(78.49,32.13) 79.18,32.82 U13.28
  Top Layer w0.203: v1(78.49,32.13) 77.72,31.37 NOREF#4.TP1 77.6,30.73 77.09,30.23 R124.1 ; R90.2 v1(88.88,42.42)
  PWR w0.254: v1(88.88,42.42) 82.55,42.42 81.79,41.66 v1(81.79,39.37) v1(79.88,39.37) 79.88,37.85 78.49,36.45 v1(78.49,32.13)
  Bottom Layer w0.203: R84.2 81.53,39.12 v1(81.79,39.37) ; v1(79.88,39.37) 79.88,39.17 R87.2 R86.2
GND: length 153.7
  Top Layer w0.127: U12.M7 68.83,48.08 v1(68.83,48.01) ; U12.M7 v1(68.83,48.64) ; U12.M7 v1(69.47,48.01) ; U12.M7 69.39,48.64 v1(69.47,48.64) ; 6.73,36.19 7.27,35.65 X1.4 ; v1(68.83,44.2) 69.11,43.92 U12.M14 69.47,44.17 v1(69.47,44.2) ; v1(68.83,44.2) 69.1,44.46 U12.M13 69.2,44.46 v1(69.47,44.2) ; v1(68.83,44.2) 68.46,43.83 ; v1(68.83,44.2) 68.73,44.2 U12.N13 v1(68.2,44.2) ; v1(72.64,48.64) 72.73,48.64 U12.F7 72.66,48.01 v1(72.64,48.01) ; v1(72.64,48.64) 72.64,48.73 U12.G6 72.63,49.28 v1(72.64,49.28) ; v1(72.64,48.64) U12.F6 72.75,49.28 v1(72.64,49.28) ; v1(72.64,48.64) U12.G7 72.64,48.08 v1(72.64,48.01) ; U12.N9 68.77,47.37 68.83,47.37 ; U12.N9 68.79,46.74 ; U12.N9 68.14,47.39 68.07,47.39 ; v1(68.83,48.64) 68.74,48.64 U12.N7 ; v1(68.83,48.64) U12.N6 ; v1(82.42,52.83) v1(84.07,52.83) v1(85.34,52.83) v1(85.34,54.99) v1(85.34,56.39) ; v1(82.42,52.83) 81.72,52.83 C81.2 ; v1(82.42,52.83) 82.42,54.18 X2.4 ; v1(77.6,46.99) 76.96,46.99 76.73,46.76 75.49,46.76 75.31,46.93 75.31,47.37 U12.C8 ; U12.B13 76.13,43.94 78.48,43.94 ; v1(68.07,49.28) 68.07,49.4 U12.P5 ; v1(68.07,49.28) 68.07,49.27 U12.P6 67.81,48.9 v1(68.07,48.64) ; v1(68.07,49.28) 68.46,49.66 U12.N5 68.83,49.29 ; 68.79,46.74 U12.N10 68.79,46.09 ; 68.79,46.74 U12.M9 ; 68.79,46.74 U12.M10 ; v1(69.47,48.01) 69.41,48.01 U12.M8 ; v1(69.47,48.01) 70.77,48.01 U12.J8 ; v1(67.44,44.2) 67.81,43.82 U12.P14 ; v1(67.44,44.2) 67.43,44.2 U12.T12 ; v1(67.44,44.2) 67.55,44.2 U12.P13 68.08,44.2 v1(68.2,44.2) ; U12.N7 68.11,48.01 ; U12.N7 68.35,48.36 v1(68.07,48.64) ; U12.N7 68.48,48.36 v1(68.83,48.01) ; 69.47,47.37 69.76,47.08 U12.L9 69.44,46.74 ; 69.47,47.37 69.13,47.71 U12.M8 ; 69.47,47.37 69.16,47.06 U12.M9 ; 68.46,43.83 U12.N14 U12.N16 ; 68.46,43.83 68.46,43.93 v1(68.2,44.2) ; C80.2 80.9,56.99 v1(80.9,57.66) v1(82.42,57.66) v1(84.07,57.66) v1(85.34,57.66) v1(85.34,56.39) ; R36.1 v1(10.05,39.52) ; U12.C7 U12.C8 ; U12.C8 74.63,47.71 73.99,47.06 U12.E9 U12.F9 U12.F8 72.94,47.71 v1(72.64,48.01) ; X2.2 85.32,56.41 v1(85.34,56.39) ; v1(72.64,45.47) 72.64,45.48 72.36,45.76 ; v1(72.64,45.47) 72.35,45.76 71.06,45.76 ; v1(72.64,45.47) 72.64,45.39 U12.G12 72.37,45.11 v1(72.65,44.84) ; v1(72.64,45.47) 72.66,45.47 U12.F12 ; v1(72.64,45.47) 72.94,45.76 73.01,45.76 ; U12.E12 73.34,44.79 v1(73.31,44.79) ; v1(91.19,42.55) 92.28,41.45 C94.1 ; v1(76.45,40.51) 76.45,41.02 U12.A18 ; 72.64,49.29 72.64,49.38 U12.G5 ; 72.64,49.29 U12.F5 73.41,49.66 73.66,49.91 74.71,49.91 U12.C5 U12.B5 75.61,49.71 75.87,49.97 76.7,49.97 v1(78.1,51.37) ; 72.64,49.29 v1(72.64,49.28) ; U12.V18 65.21,40.58 v1(64.9,40.26) ; v1(68.07,48.01) 68.07,47.97 U12.P8 68.07,47.46 68.07,47.39 ; v1(68.07,48.01) 68.07,48.1 U12.P7 68.07,48.62 v1(68.07,48.64) ; v1(68.07,48.01) 68.11,48.01 ; U12.F13 73.31,44.75 v1(73.31,44.79) ; U12.F13 73.01,44.47 v1(72.65,44.84) ; U12.F13 U12.F14 73.03,43.8 v1(73.03,43.31) 73.52,43.31 U12.D16 ; 69.44,46.09 U12.L10 69.44,46.74 ; 69.44,46.09 69.11,45.76 68.79,46.09 ; 69.44,46.09 U12.M10 ; 69.44,46.09 69.76,45.76 ; v1(77.72,42.29) 77.22,42.8 75.98,42.8 U12.B15 ; U12.M10 69.44,46.74 ; U12.M10 68.79,46.09 ; 69.44,46.74 U12.M9 ; 68.79,46.09 68.46,45.76 ; 67.79,43.81 67.8,43.81 U12.P14 ; 67.79,43.81 67.75,43.77 v1(66.98,43.77) 66.56,43.77 U12.T14 ; 67.79,43.81 67.81,43.81 U12.P14 ; 68.83,47.37 68.49,47.71 U12.N8 ; 68.83,47.37 68.83,47.43 U12.M8 ; 68.83,47.37 69.11,47.09 U12.M9 ; U12.N8 68.76,48.01 v1(68.83,48.01) ; U12.N8 68.17,48.01 68.11,48.01 ; U12.N8 68.14,47.39 ; U12.N6 68.57,49.01 v1(68.83,49.28) 68.83,49.29 ; U12.N6 68.09,48.64 v1(68.07,48.64) ; U12.K3 70.72,51.27 71.33,51.27 71.68,51.61 71.71,51.61 v1(71.12,52.2) ; U12.K3 70.41,51.18 70.11,51.48 70.11,51.94 v1(69.85,52.2) ; U12.K3 70.39,50.96 69.98,50.55 69.53,50.55 U12.M3 ; v1(79.88,49.15) 79.92,49.19 C82.2 82,49.15 ; U12.P14 v1(68.2,44.2) ; 68.07,47.39 68.07,47.31 U12.P9 ; v1(68.83,48.01) 69.11,47.73 U12.M8 ; U12.H2 72.3,52.2 v1(72.39,52.2) ; U12.G8 72.64,47.99 v1(72.64,48.01) ; U12.M5 68.83,49.38 68.83,49.29 ; U12.R18 67.56,40.81 v1(67.56,40.26) ; U12.J17 71.06,41.88 v1(71.36,42.17) 71.36,42.21 U12.J16 ; U12.T16 66.83,42.19 66.83,40.23 ; v1(73.31,44.79) 73.31,44.82 U12.F12 ; U11.49 17.4,35.49 17.9,35.99 U11.40 ; v1(72.65,44.84) 72.74,44.84 U12.F12 ; 65.21,52.26 65.53,52.58 v1(65.53,52.7) ; v1(69.47,44.2) 69.76,43.9 U12.L14 70.1,44.15 v1(70.1,44.2) 70.41,43.89 U12.K14 ; C83.2 81.11,51.86 80.52,52.45 v1(80.39,52.45) ; SW1.2 v1(88.84,85.72) ; 76.26,52.26 U12.B2 75.61,51.64 75.31,51.94 74.17,51.94 v1(73.66,52.45)
  Top Layer w0.203: 8.89,30.99 v1(9.14,30.73) ; 8.89,30.99 v1(6.6,30.99) 5.56,30.99 ; 8.89,30.99 8.89,31.48 C58.1 ; 5.56,30.99 5.57,31.01 X1.2 ; 5.56,30.99 v1(4.19,30.99) v1(4.19,32.39) v1(4.19,34.54) v1(4.19,36.19) v1(5.33,36.19) v1(6.6,36.19) v1(9.14,36.19) 8.85,35.9 C57.1 ; v1(63.75,81.92) 63.49,81.65 U6.3 ; U6.11 63.23,79.65 v1(63.63,79.25) ; U6.27 v1(63.37,75.65) ; v1(64.13,81.41) 63.88,81.15 U6.5 ; U6.39 v1(63.37,72.65) ; U6.57 v1(63.37,68.15) ; U6.33 v1(63.37,74.15) ; U6.51 v1(63.37,69.65) ; U6.45 v1(63.37,71.15)
  Top Layer w0.406: v2(40.34,18.79) 40.66,19.11 U1.3 ; v2(29.59,28.07) 29.92,28.39 U2.3
  Bottom Layer w0.127: C90.2 85.02,35.36 v1(84.33,34.67)
  vias: v1(12.57,50.67) v1(12.57,49.66) v1(12.83,46.99) v1(13.33,51.69) v1(14.1,26.8) v1(14.1,25.53) v1(14.1,24.26) v1(14.35,52.45) v1(14.48,46.99) v1(14.61,49.66) v1(15.37,52.45) v1(15.37,50.67) v1(15.49,46.99) v1(15.49,45.97) v1(15.49,44.7) v1(15.62,26.8) v1(15.62,25.53) v1(15.62,24.26) v1(15.62,23.11) v1(15.75,72.9) v1(15.75,72.01) v1(15.75,71.12) v1(15.75,70.23) v1(15.75,69.34) v1(15.75,68.45) v1(15.75,67.56) v1(15.75,66.67) v1(15.75,65.79) v1(15.75,61.72) v1(15.75,60.83) v1(15.75,59.94) v1(15.75,59.06) v1(15.75,58.17) v1(15.75,57.28) v1(15.75,56.39) v1(17.53,24) v1(18.03,52.45) v1(18.03,50.42) v1(18.16,72.9) v1(18.16,72.01) v1(18.16,71.12) v1(18.16,70.23) v1(18.16,69.34) v1(18.16,68.45) v1(18.16,67.56) v1(18.16,66.67) v1(18.16,65.79) v1(18.29,23.24) v1(18.42,61.72) v1(18.42,60.83) v1(18.42,59.94) v1(18.42,59.06) v1(18.42,58.17) v1(18.42,57.28) v1(18.42,56.39) v1(18.42,55.5) v1(18.54,26.54) v1(18.67,46.99) v1(18.67,45.97) v1(18.67,45.08) v1(18.92,52.45) v1(18.92,50.42) v1(18.92,25.78) v1(19.81,50.42) v1(19.81,25.02) v1(20.07,23.24) v1(21.59,52.45) v1(22.1,62.48) v1(22.1,61.59) v1(22.1,60.71) v1(22.1,59.82) v1(22.1,58.93) v1(22.1,58.04) v1(22.1,57.15) v1(22.35,69.47) v1(22.35,68.58) v1(22.35,67.69) v1(22.35,66.8) v1(22.35,65.91) v1(22.35,65.02) v1(22.48,50.42) v1(24,52.32) v1(24.13,69.47) v1(24.13,68.58) v1(24.13,67.69) v1(24.13,66.8) v1(24.13,65.91) v1(24.13,65.02) v1(24.64,62.48) v1(24.64,61.59) v1(24.64,60.71) v1(24.64,59.82) v1(24.64,58.93) v1(24.77,78.49) v1(24.89,52.32) v1(25.65,78.49) v1(25.78,52.32) v1(26.54,78.49) v1(26.67,52.32) v1(27.31,23.37) v1(27.31,22.48) v1(27.31,21.59) v1(27.31,20.7) v1(27.31,19.81) v1(27.31,18.92) v1(27.31,18.03) v1(27.31,17.15) v1(27.31,16.26) v1(27.43,78.49) v1(28.32,78.49) v1(29.21,78.49) v1(29.59,23.37) v1(29.59,22.48) v1(29.59,21.59) v1(29.59,20.7) v1(29.59,19.81) v1(29.59,18.92) v1(29.59,18.03) v1(29.59,17.15) v1(29.59,16.26) v1(32,72.26) v1(32,71.5) v1(33.27,71.5) v1(34.67,17.27) v1(34.67,16) v1(35.81,17.27) v1(36.45,69.22) v1(36.58,54.74) v1(37.34,69.22) v1(37.47,54.74) v1(37.47,35.81) v1(37.47,34.92) v1(37.47,34.04) v1(37.47,33.15) v1(37.47,32.26) v1(37.47,31.37) v1(37.47,30.48) v1(37.47,29.59) v1(37.47,28.7) v1(37.85,67.94) v1(38.23,71.37) v1(38.23,69.22) v1(38.35,54.74) v1(38.74,67.94) v1(39.12,69.22) v1(39.12,16) v1(39.24,54.74) v1(39.62,67.94) v1(40,69.22) v1(40.13,62.23) v1(40.13,54.74) v1(40.13,16) v1(40.51,67.94) v1(40.89,69.22) v1(41.02,62.23) v1(41.02,54.74) v1(41.4,67.94) v1(41.78,69.22) v1(41.91,74.68) v1(41.91,62.23) v1(41.91,54.74) v1(42.29,67.94) v1(42.67,69.22) v1(42.8,74.68) v1(42.8,62.23) v1(42.8,54.74) v1(43.18,67.94) v1(43.56,69.22) v1(43.69,74.68) v1(43.69,62.23) v1(43.69,54.74) v1(44.58,74.68) v1(44.58,62.23) v1(45.47,74.68) v1(45.47,62.23) v1(45.72,30.73) v1(46.35,74.68) v1(46.35,62.23) v1(46.61,30.73) v1(47.24,74.68) v1(47.24,62.23) v1(47.5,30.73) v1(48.13,74.68) v1(48.26,8.38) v1(48.39,30.73) v1(48.64,9.27) v1(49.02,74.68) v1(49.33,45.36) v1(49.28,30.73) v1(49.78,9.02) v1(50.04,5.59) v1(50.16,30.73) v1(50.67,21.21) v1(50.67,20.32) v1(50.67,19.43) v1(50.67,18.54) v1(50.67,17.65) v1(50.67,16.76) v1(50.67,15.49) v1(50.67,14.1) v1(51.05,30.73) v1(51.05,5.59) v1(51.94,30.73) v1(52.32,61.98) v1(52.32,60.2) v1(52.83,30.73) v1(52.83,15.49) v1(52.83,14.1) v1(53.09,21.21) v1(53.09,20.32) v1(53.09,19.43) v1(53.09,18.54) v1(53.09,17.65) v1(53.09,16.76) v1(53.72,60.33) v1(53.75,61.98) v1(57.53,69.47) v1(57.91,78.23) v1(58.17,77.22) v1(58.29,75.95) v1(58.29,74.68) v1(58.29,73.15) v1(58.8,71.88) v1(59.56,33.27) v1(59.94,27.43) v1(60.71,39.88) v1(60.71,38.61) v1(60.71,37.34) v1(60.71,36.07) v1(61.21,43.94) v1(61.21,43.05) v1(61.21,42.16) v1(61.98,38.35) v1(61.98,37.47) v1(61.98,36.58) v1(61.98,35.69) v1(61.98,34.8) v1(61.98,33.91) v1(61.98,22.99) v1(62.23,43.05) v1(62.23,42.16) v1(62.48,24.77) v1(62.61,41.15) v1(62.99,9.65) v1(63.12,25.91) v1(63.25,44.2) v1(63.88,43.56) v1(64.01,41.15) v1(64.26,42.16) v1(64.26,9.02) v1(64.52,38.35) v1(64.52,37.47) v1(64.52,36.58) v1(64.52,35.69) v1(64.52,34.8) v1(64.52,33.91) v1(64.77,42.93) v1(65.41,68.83) v1(65.53,55.5) v1(65.66,9.65) v1(66.29,32.77) v1(66.29,31.88) v1(66.29,30.99) v1(66.29,30.1) v1(66.29,29.21) v1(66.29,28.32) v1(66.29,27.43) v1(66.29,26.54) v1(66.29,25.65) v1(66.83,40.26) v1(69.6,28.58) v1(69.6,27.31) v1(69.6,25.91) v1(71.12,32.64) v1(71.12,31.37) v1(71.88,69.09) v1(72.39,33.4) v1(72.9,75.95) v1(73.15,70.48) v1(73.79,29.08) v1(73.79,27.94) v1(73.79,26.54) v1(73.91,33.4) v1(74.29,38.99) v1(74.55,70.99) v1(74.92,73.49) v1(75.06,36.83) v1(75.31,33.91) v1(75.68,73.11) v1(75.82,36.45) v1(75.82,35.43) v1(76.19,78.06) v1(76.2,75.06) v1(76.45,73.49) v1(76.71,69.6) v1(76.76,70.89) v1(77.34,77.6) v1(77.34,75.44) v1(77.47,56.77) v1(77.98,58.29) v1(77.98,36.83) v1(77.98,35.81) v1(78.1,52.32) v1(78.36,70.36) v1(78.36,68.58) v1(78.49,56.77) v1(78.49,43.94) v1(78.49,42.93) v1(79.12,35.56) v1(79.5,25.91) v1(79.63,53.59) v1(79.63,52.45) v1(79.63,51.44) v1(79.63,36.45) v1(79.76,42.29) v1(81.28,42.29) v1(81.41,22.35) v1(81.74,25.65) v1(82.04,45.59) v1(82.8,44.32) v1(82.8,24.64) v1(82.93,73.79) v1(82.99,25.65) v1(83.82,38.61) v1(83.95,41.02) v1(84.33,44.32) v1(84.33,33.91) v1(84.33,33.15) v1(84.58,25.65) v1(84.58,24.64) v1(84.84,28.7) v1(84.96,40.26) v1(85.09,39.12) v1(85.47,43.18) v1(85.72,44.83) v1(86.23,84.2) v1(86.49,75.18) v1(86.49,24.64) v1(86.61,57.15) v1(86.61,56.26) v1(86.61,55.37) v1(86.61,54.48) v1(86.61,53.59) v1(86.61,52.7) v1(86.61,51.82) v1(86.61,50.93) v1(86.61,50.04) v1(86.74,44.2) v1(86.74,41.91) v1(86.74,25.4) v1(87.12,85.72) v1(87.5,39.62) v1(87.76,44.2) v1(87.76,43.05) v1(87.88,41.55) v1(88.01,84.2) v1(88.26,25.78) v1(88.39,30.48) v1(88.65,36.58) v1(89.03,28.83) v1(89.28,44.2) v1(89.28,43.05) v1(89.28,22.86) v1(89.66,58.17) v1(90.55,58.17) v1(90.55,21.97) v1(91.06,24.64) v1(91.19,44.58) v1(91.19,43.56) v1(91.44,58.17) v1(91.82,26.42) v1(91.82,23.11) v1(92.33,58.17) v1(93.09,24.38) v1(93.22,58.17) v1(93.47,31.11) v1(93.47,29.59) v1(93.47,27.81) v1(93.47,26.03) v1(94.11,58.17) v1(94.36,46.99) v1(94.36,45.21) v1(94.36,43.43) v1(94.36,41.66) v1(94.36,39.88) v1(94.49,36.58) v1(94.87,31.11) v1(94.87,29.59) v1(94.87,27.81) v1(94.87,26.03) v1(95,58.17) v1(95.88,58.17) v1(96.77,58.17)
